# Altium project SCB.PrjPCB (part 5 of 6)

## Sheet FPGA_POWER_DGND.SchDoc
size A3
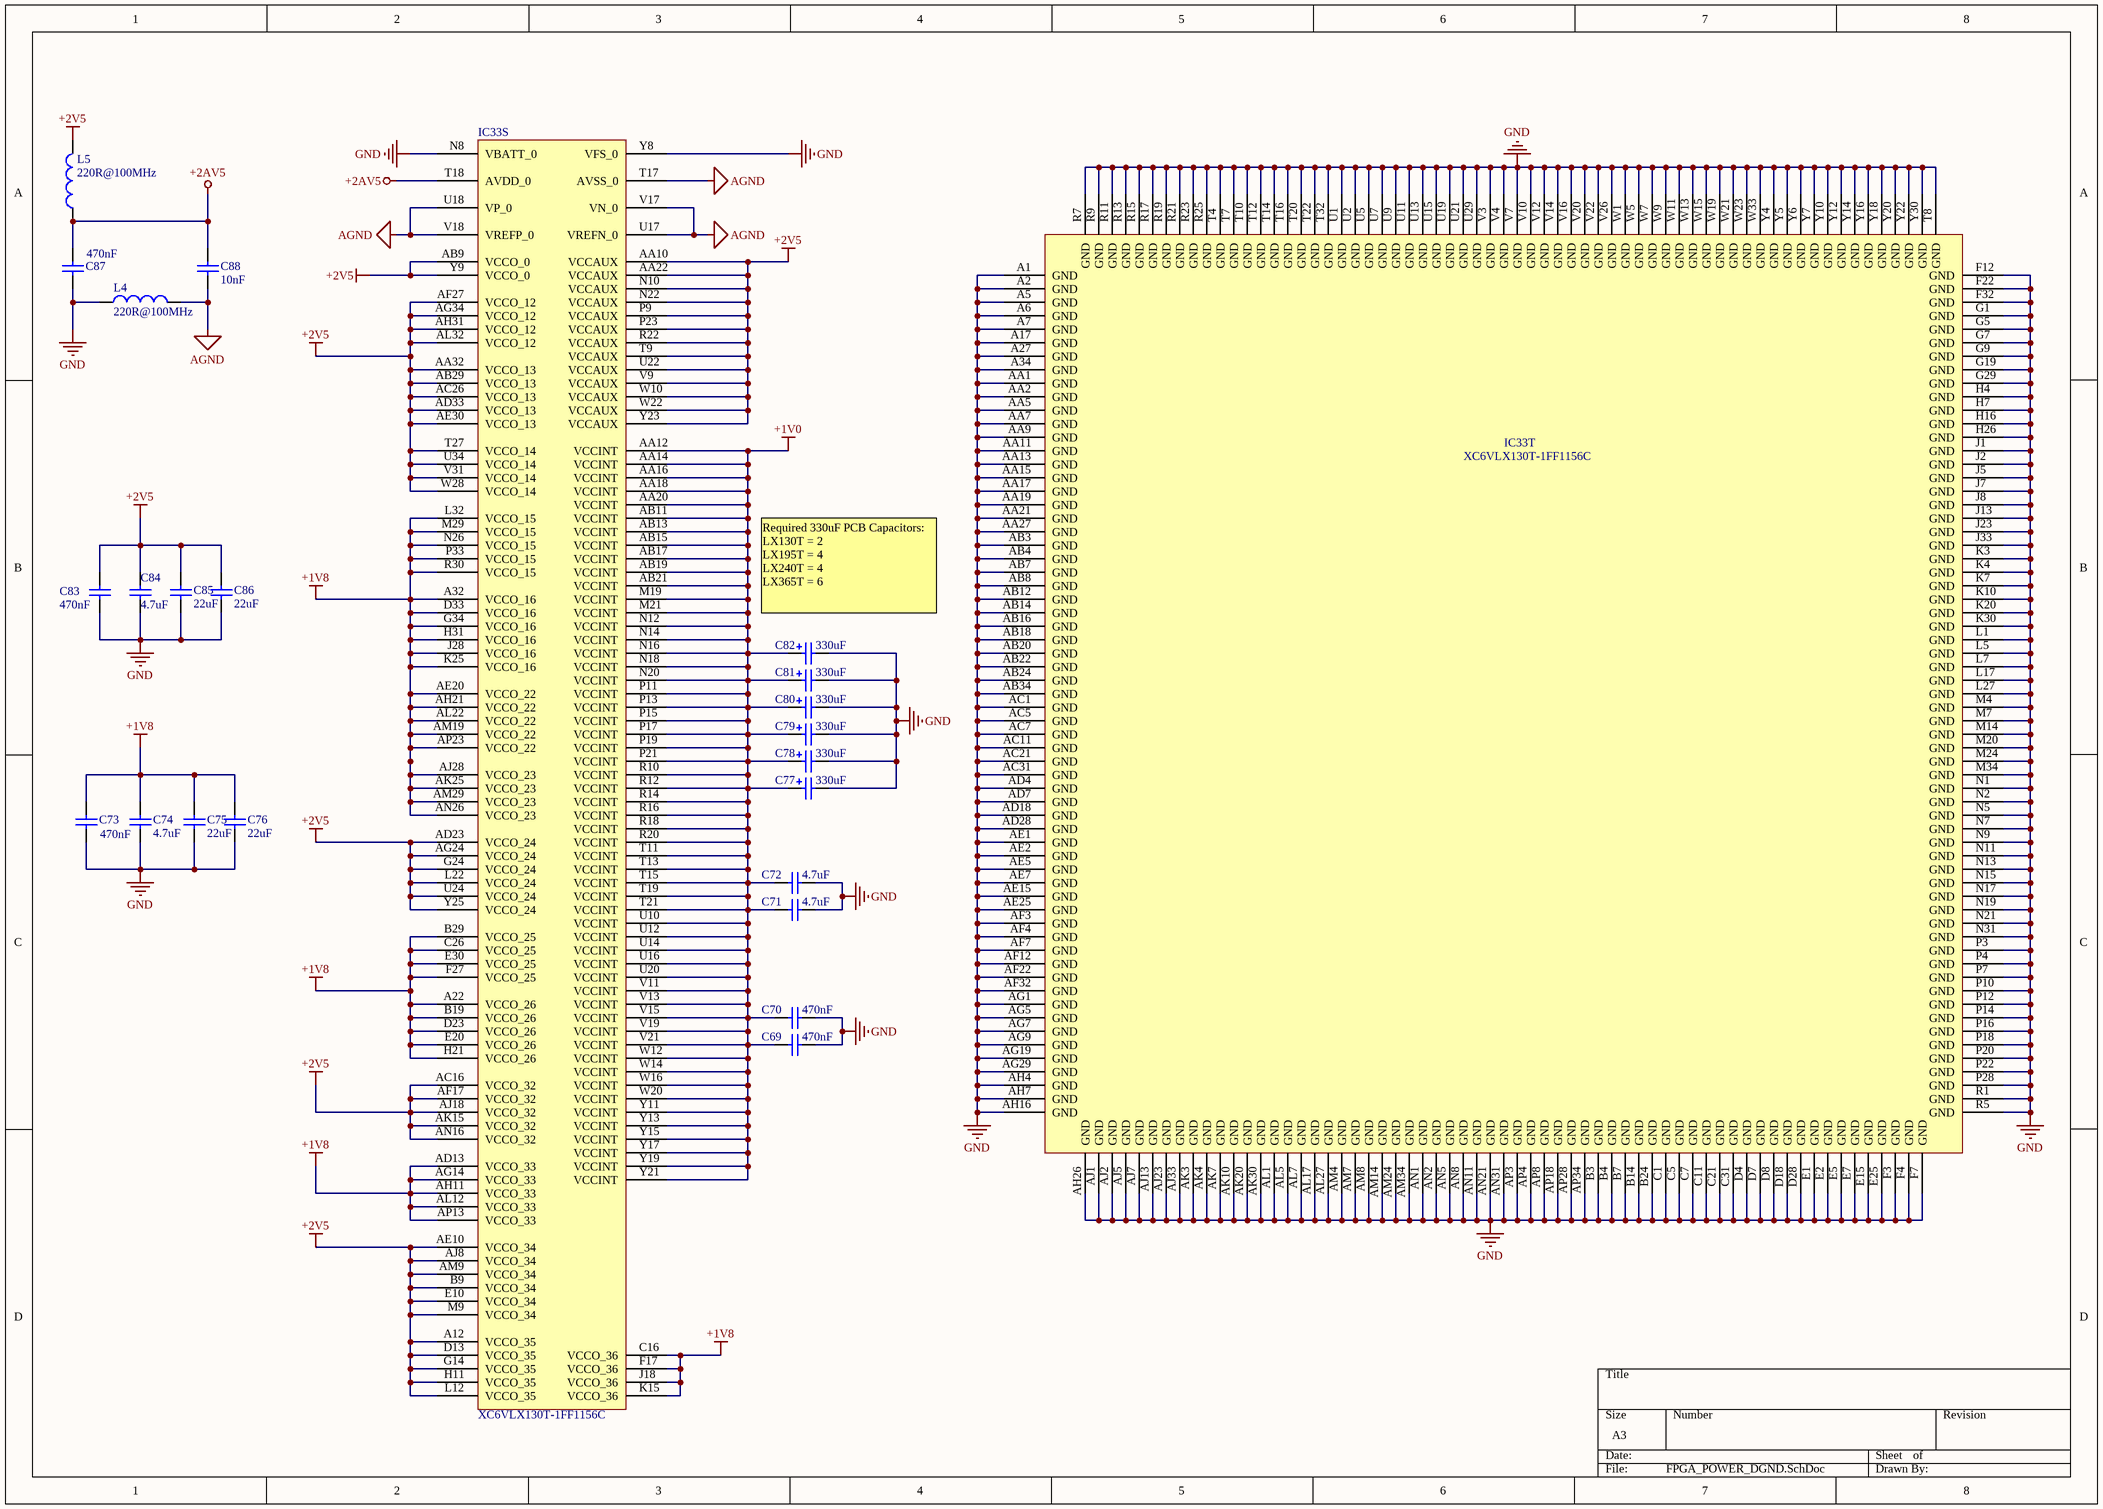
[diagram p18: FPGA_POWER_DGND.SchDoc]

### Parts
C69  470nF  [CC1005-0402]
C70  470nF  [CC1005-0402]
C71  4.7uF  [CC1608-0603]
C72  4.7uF  [CC1608-0603]
C73  470nF  [CC1005-0402]
C74  4.7uF  [CC1608-0603]
C75  22uF  [CC2012-0805]
C76  22uF  [CC2012-0805]
C77  330uF  [D]
C78  330uF  [D]
C79  330uF  [D]
C80  330uF  [D]
C81  330uF  [D]
C82  330uF  [D]
C83  470nF  [CC1005-0402]
C84  4.7uF  [CC1608-0603]
C85  22uF  [CC2012-0805]
C86  22uF  [CC2012-0805]
C87  470nF  [CC1005-0402]
C88  10nF  [CC1005-0402]
IC33  XC6VLX130T-1FF1156C  [FF1156]  (parts S,T of 20)
L4  Impedance: 220R@100MHz  [0603]  (hidden comment: 220R@100MHz Ferrite Bead)
L5  Impedance: 220R@100MHz  [0603]  (hidden comment: 220R@100MHz Ferrite Bead)

### Nets
+1V0: C69.2 C70.2 C71.1 C72.1 C77.1 C78.1 C79.1 C80.1 C81.1 C82.1 IC33.AA12(VCCINT) IC33.AA14(VCCINT) IC33.AA16(VCCINT) IC33.AA18(VCCINT) IC33.AA20(VCCINT) IC33.AB11(VCCINT) IC33.AB13(VCCINT) IC33.AB15(VCCINT) IC33.AB17(VCCINT) IC33.AB19(VCCINT) IC33.AB21(VCCINT) IC33.M19(VCCINT) IC33.M21(VCCINT) IC33.N12(VCCINT) IC33.N14(VCCINT) IC33.N16(VCCINT) IC33.N18(VCCINT) IC33.N20(VCCINT) IC33.P11(VCCINT) IC33.P13(VCCINT) IC33.P15(VCCINT) IC33.P17(VCCINT) IC33.P19(VCCINT) IC33.P21(VCCINT) IC33.R10(VCCINT) IC33.R12(VCCINT) IC33.R14(VCCINT) IC33.R16(VCCINT) IC33.R18(VCCINT) IC33.R20(VCCINT) IC33.T11(VCCINT) IC33.T13(VCCINT) IC33.T15(VCCINT) IC33.T19(VCCINT) IC33.T21(VCCINT) IC33.U10(VCCINT) IC33.U12(VCCINT) IC33.U14(VCCINT) IC33.U16(VCCINT) IC33.U20(VCCINT) IC33.V11(VCCINT) IC33.V13(VCCINT) IC33.V15(VCCINT) IC33.V19(VCCINT) IC33.V21(VCCINT) IC33.W12(VCCINT) IC33.W14(VCCINT) IC33.W16(VCCINT) IC33.W20(VCCINT) IC33.Y11(VCCINT) IC33.Y13(VCCINT) IC33.Y15(VCCINT) IC33.Y17(VCCINT) IC33.Y19(VCCINT) IC33.Y21(VCCINT)
+1V8: C73.1 C74.2 C75.2 C76.2 IC33.A22(VCCO_26) IC33.A32(VCCO_16) IC33.AD13(VCCO_33) IC33.AE20(VCCO_22) IC33.AG14(VCCO_33) IC33.AH11(VCCO_33) IC33.AH21(VCCO_22) IC33.AJ28(VCCO_23) IC33.AK25(VCCO_23) IC33.AL12(VCCO_33) IC33.AL22(VCCO_22) IC33.AM19(VCCO_22) IC33.AM29(VCCO_23) IC33.AN26(VCCO_23) IC33.AP13(VCCO_33) IC33.AP23(VCCO_22) IC33.B19(VCCO_26) IC33.B29(VCCO_25) IC33.C16(VCCO_36) IC33.C26(VCCO_25) IC33.D23(VCCO_26) IC33.D33(VCCO_16) IC33.E20(VCCO_26) IC33.E30(VCCO_25) IC33.F17(VCCO_36) IC33.F27(VCCO_25) IC33.G34(VCCO_16) IC33.H21(VCCO_26) IC33.H31(VCCO_16) IC33.J18(VCCO_36) IC33.J28(VCCO_16) IC33.K15(VCCO_36) IC33.K25(VCCO_16) IC33.L32(VCCO_15) IC33.M29(VCCO_15) IC33.N26(VCCO_15) IC33.P33(VCCO_15) IC33.R30(VCCO_15)
+2AV5: C87.1 C88.1 IC33.T18(AVDD_0) L5.1
+2V5: C83.1 C84.2 C85.2 C86.2 IC33.A12(VCCO_35) IC33.AA10(VCCAUX) IC33.AA22(VCCAUX) IC33.AA32(VCCO_13) IC33.AB9(VCCO_0) IC33.AB29(VCCO_13) IC33.AC16(VCCO_32) IC33.AC26(VCCO_13) IC33.AD23(VCCO_24) IC33.AD33(VCCO_13) IC33.AE10(VCCO_34) IC33.AE30(VCCO_13) IC33.AF17(VCCO_32) IC33.AF27(VCCO_12) IC33.AG24(VCCO_24) IC33.AG34(VCCO_12) IC33.AH31(VCCO_12) IC33.AJ8(VCCO_34) IC33.AJ18(VCCO_32) IC33.AK15(VCCO_32) IC33.AL32(VCCO_12) IC33.AM9(VCCO_34) IC33.AN16(VCCO_32) IC33.B9(VCCO_34) IC33.D13(VCCO_35) IC33.E10(VCCO_34) IC33.G14(VCCO_35) IC33.G24(VCCO_24) IC33.H11(VCCO_35) IC33.L12(VCCO_35) IC33.L22(VCCO_24) IC33.M9(VCCO_34) IC33.N10(VCCAUX) IC33.N22(VCCAUX) IC33.P9(VCCAUX) IC33.P23(VCCAUX) IC33.R22(VCCAUX) IC33.T9(VCCAUX) IC33.T27(VCCO_14) IC33.U22(VCCAUX) IC33.U24(VCCO_24) IC33.U34(VCCO_14) IC33.V9(VCCAUX) IC33.V31(VCCO_14) IC33.W10(VCCAUX) IC33.W22(VCCAUX) IC33.W28(VCCO_14) IC33.Y9(VCCO_0) IC33.Y23(VCCAUX) IC33.Y25(VCCO_24) L5.2
AGND: C88.2 IC33.T17(AVSS_0) IC33.U17(VREFN_0) IC33.U18(VP_0) IC33.V17(VN_0) IC33.V18(VREFP_0) L4.2
GND: C69.1 C70.1 C71.2 C72.2 C73.2 C74.1 C75.1 C76.1 C77.2 C78.2 C79.2 C80.2 C81.2 C82.2 C83.2 C84.1 C85.1 C86.1 C87.2 IC33.A1(GND) IC33.A2(GND) IC33.A5(GND) IC33.A6(GND) IC33.A7(GND) IC33.A17(GND) IC33.A27(GND) IC33.A34(GND) IC33.AA1(GND) IC33.AA2(GND) IC33.AA5(GND) IC33.AA7(GND) IC33.AA9(GND) IC33.AA11(GND) IC33.AA13(GND) IC33.AA15(GND) IC33.AA17(GND) IC33.AA19(GND) IC33.AA21(GND) IC33.AA27(GND) IC33.AB3(GND) IC33.AB4(GND) IC33.AB7(GND) IC33.AB8(GND) IC33.AB12(GND) IC33.AB14(GND) IC33.AB16(GND) IC33.AB18(GND) IC33.AB20(GND) IC33.AB22(GND) IC33.AB24(GND) IC33.AB34(GND) IC33.AC1(GND) IC33.AC5(GND) IC33.AC7(GND) IC33.AC11(GND) IC33.AC21(GND) IC33.AC31(GND) IC33.AD4(GND) IC33.AD7(GND) IC33.AD18(GND) IC33.AD28(GND) IC33.AE1(GND) IC33.AE2(GND) IC33.AE5(GND) IC33.AE7(GND) IC33.AE15(GND) IC33.AE25(GND) IC33.AF3(GND) IC33.AF4(GND) IC33.AF7(GND) IC33.AF12(GND) IC33.AF22(GND) IC33.AF32(GND) IC33.AG1(GND) IC33.AG5(GND) IC33.AG7(GND) IC33.AG9(GND) IC33.AG19(GND) IC33.AG29(GND) IC33.AH4(GND) IC33.AH7(GND) IC33.AH16(GND) IC33.AH26(GND) IC33.AJ1(GND) IC33.AJ2(GND) IC33.AJ5(GND) IC33.AJ7(GND) IC33.AJ13(GND) IC33.AJ23(GND) IC33.AJ33(GND) IC33.AK3(GND) IC33.AK4(GND) IC33.AK7(GND) IC33.AK10(GND) IC33.AK20(GND) IC33.AK30(GND) IC33.AL1(GND) IC33.AL5(GND) IC33.AL7(GND) IC33.AL17(GND) IC33.AL27(GND) IC33.AM4(GND) IC33.AM7(GND) IC33.AM8(GND) IC33.AM14(GND) IC33.AM24(GND) IC33.AM34(GND) IC33.AN1(GND) IC33.AN2(GND) IC33.AN5(GND) IC33.AN8(GND) IC33.AN11(GND) IC33.AN21(GND) IC33.AN31(GND) IC33.AP3(GND) IC33.AP4(GND) IC33.AP8(GND) IC33.AP18(GND) IC33.AP28(GND) IC33.AP34(GND) IC33.B3(GND) IC33.B4(GND) IC33.B7(GND) IC33.B14(GND) IC33.B24(GND) IC33.C1(GND) IC33.C5(GND) IC33.C7(GND) IC33.C11(GND) IC33.C21(GND) IC33.C31(GND) IC33.D4(GND) IC33.D7(GND) IC33.D8(GND) IC33.D18(GND) IC33.D28(GND) IC33.E1(GND) IC33.E2(GND) IC33.E5(GND) IC33.E7(GND) IC33.E15(GND) IC33.E25(GND) IC33.F3(GND) IC33.F4(GND) IC33.F7(GND) IC33.F12(GND) IC33.F22(GND) IC33.F32(GND) IC33.G1(GND) IC33.G5(GND) IC33.G7(GND) IC33.G9(GND) IC33.G19(GND) IC33.G29(GND) IC33.H4(GND) IC33.H7(GND) IC33.H16(GND) IC33.H26(GND) IC33.J1(GND) IC33.J2(GND) IC33.J5(GND) IC33.J7(GND) IC33.J8(GND) IC33.J13(GND) IC33.J23(GND) IC33.J33(GND) IC33.K3(GND) IC33.K4(GND) IC33.K7(GND) IC33.K10(GND) IC33.K20(GND) IC33.K30(GND) IC33.L1(GND) IC33.L5(GND) IC33.L7(GND) IC33.L17(GND) IC33.L27(GND) IC33.M4(GND) IC33.M7(GND) IC33.M14(GND) IC33.M20(GND) IC33.M24(GND) IC33.M34(GND) IC33.N1(GND) IC33.N2(GND) IC33.N5(GND) IC33.N7(GND) IC33.N8(VBATT_0) IC33.N9(GND) IC33.N11(GND) IC33.N13(GND) IC33.N15(GND) IC33.N17(GND) IC33.N19(GND) IC33.N21(GND) IC33.N31(GND) IC33.P3(GND) IC33.P4(GND) IC33.P7(GND) IC33.P10(GND) IC33.P12(GND) IC33.P14(GND) IC33.P16(GND) IC33.P18(GND) IC33.P20(GND) IC33.P22(GND) IC33.P28(GND) IC33.R1(GND) IC33.R5(GND) IC33.R7(GND) IC33.R9(GND) IC33.R11(GND) IC33.R13(GND) IC33.R15(GND) IC33.R17(GND) IC33.R19(GND) IC33.R21(GND) IC33.R23(GND) IC33.R25(GND) IC33.T4(GND) IC33.T7(GND) IC33.T8(GND) IC33.T10(GND) IC33.T12(GND) IC33.T14(GND) IC33.T16(GND) IC33.T20(GND) IC33.T22(GND) IC33.T32(GND) IC33.U1(GND) IC33.U2(GND) IC33.U5(GND) IC33.U7(GND) IC33.U9(GND) IC33.U11(GND) IC33.U13(GND) IC33.U15(GND) IC33.U19(GND) IC33.U21(GND) IC33.U29(GND) IC33.V3(GND) IC33.V4(GND) IC33.V7(GND) IC33.V10(GND) IC33.V12(GND) IC33.V14(GND) IC33.V16(GND) IC33.V20(GND) IC33.V22(GND) IC33.V26(GND) IC33.W1(GND) IC33.W5(GND) IC33.W7(GND) IC33.W9(GND) IC33.W11(GND) IC33.W13(GND) IC33.W15(GND) IC33.W19(GND) IC33.W21(GND) IC33.W23(GND) IC33.W33(GND) IC33.Y4(GND) IC33.Y5(GND) IC33.Y6(GND) IC33.Y7(GND) IC33.Y8(VFS_0) IC33.Y10(GND) IC33.Y12(GND) IC33.Y14(GND) IC33.Y16(GND) IC33.Y18(GND) IC33.Y20(GND) IC33.Y22(GND) IC33.Y30(GND) L4.1

### Notes on the sheet
- (near C82) Required 330uF PCB Capacitors:
  LX130T = 2
  LX195T = 4
  LX240T = 4
  LX365T = 6

### Library data of the parts
C69 C70 C73 C83 C87 = CC0402_470NF_16V_10%_X5R: Capacitor; Manufacturer1: TDK; Manufacturer1 PN: C1005X5R1C474K; TC: X5R; Tolerance: ±10%; Voltage: 16V; Published: 8-Jun-2000; LatestRevisionDate: 17-Jul-2002; LatestRevisionNote: Re-released for DXP Platform.; PackageReference: RAD-0.3; Publisher: Altium Limited; Distributor1: Digikey; Distributor1 PN: 445-4976-1-ND; Case: 0402; Value: 470nF
C71 C72 C74 C84 = CC0603_4.7UF_10V_10%_X5R: as C238 on sheet Power_Supply; Published: 8-Jun-2000; LatestRevisionDate: 17-Jul-2002; LatestRevisionNote: Re-released for DXP Platform.; PackageReference: RAD-0.3; Publisher: Altium Limited; Distributor1: Digikey; Distributor1 PN: 445-5170-1-ND; Case: 0603; Value: 4.7uF
C75 C76 C85 C86 = CC0805_22UF_6.3V_20%_X5R: Capacitor; Manufacturer1: TDK; Manufacturer1 PN: C2012X5R0J226M; TC: X5R; Tolerance: ±20%; Voltage: 6.3V; Published: 8-Jun-2000; LatestRevisionDate: 17-Jul-2002; LatestRevisionNote: Re-released for DXP Platform.; PackageReference: RAD-0.3; Publisher: Altium Limited; Distributor1: Digikey; Distributor1 PN: 445-1422-1-ND; Case: 0805; Value: 22uF
C77-C82 = CP2917_330UF_6.3V_20%_TANT: Polarized Capacitor Tantalum; Manufacturer1: Kemet; Manufacturer1 PN: T520D337M006ATE025; Tolerance: ±20%; Voltage: 6.3V; ESR: 25mOhm; Published: 8-Jun-2000; LatestRevisionDate: 17-Jul-2002; LatestRevisionNote: Re-released for DXP Platform.; PackageReference: RB7.6-15; Publisher: Altium Limited; Case: 2917; Distributor1: Digikey; Distributor1 PN: 399-4053-1-ND; TC: Tantalum; Value: 330uF
C88 = CC0402_10NF_25V_10%_X7R: Capacitor; Manufacturer1: TDK; Manufacturer1 PN: C1005X7R1E103K; TC: X7R; Tolerance: ±10%; Voltage: 25V; Published: 8-Jun-2000; LatestRevisionDate: 17-Jul-2002; LatestRevisionNote: Re-released for DXP Platform.; PackageReference: RAD-0.3; Publisher: Altium Limited; Distributor1: Digikey; Distributor1 PN: 445-1260-1-ND; Case: 0402; Value: 10nF
IC33 = XC6VLX130T-1FF1156C: as IC33 on sheet FPGA_GPIOs; FirstPublished: 17-Nov-2009; DatasheetVersion: v2.0, Sep-2009; PackageVersion: ver1.0, Jun-2009; PackageReference: FF1156; Publisher: Altium Limited; PackageDescription: 1156-Ball Flip-Chip Fine Pitch Ball Grid Array (FF1156); Code_JEDEC: MS-034-AAR-1; Code_IPC: BGA100P34X34-1156; ComponentLink1Description: Virtex-6 Datasheet; ComponentLink1URL: http://www.xilinx.com/support/documentation/data_sheets/ds150.pdf; ComponentLink2Description: Pinout Specification; ComponentLink2URL: http://www.xilinx.com/support/packagefiles/virtex-6-pkgs.htm; ComponentLink3Description: FF1156 Package Drawing; ComponentLink3URL: http://www.xilinx.com/support/documentation/package_specs/ff1156.pdf; ComponentLink4Description: Virtex-6 Documents; ComponentLink4URL: http://www.xilinx.com/support/documentation/virtex-6.htm; ComponentLink5Description: Xilinx.com Home; ComponentLink5URL: http://www.xilinx.com
L4 L5 = L_FERRITE_BEAD: as L6-L8 on sheet SCB_PLLs; Case: 0603; Distributor1: Digikey; Distributor1 PN: 490-5255-1-ND

## Sheet QDRII_mem.SchDoc
size A3
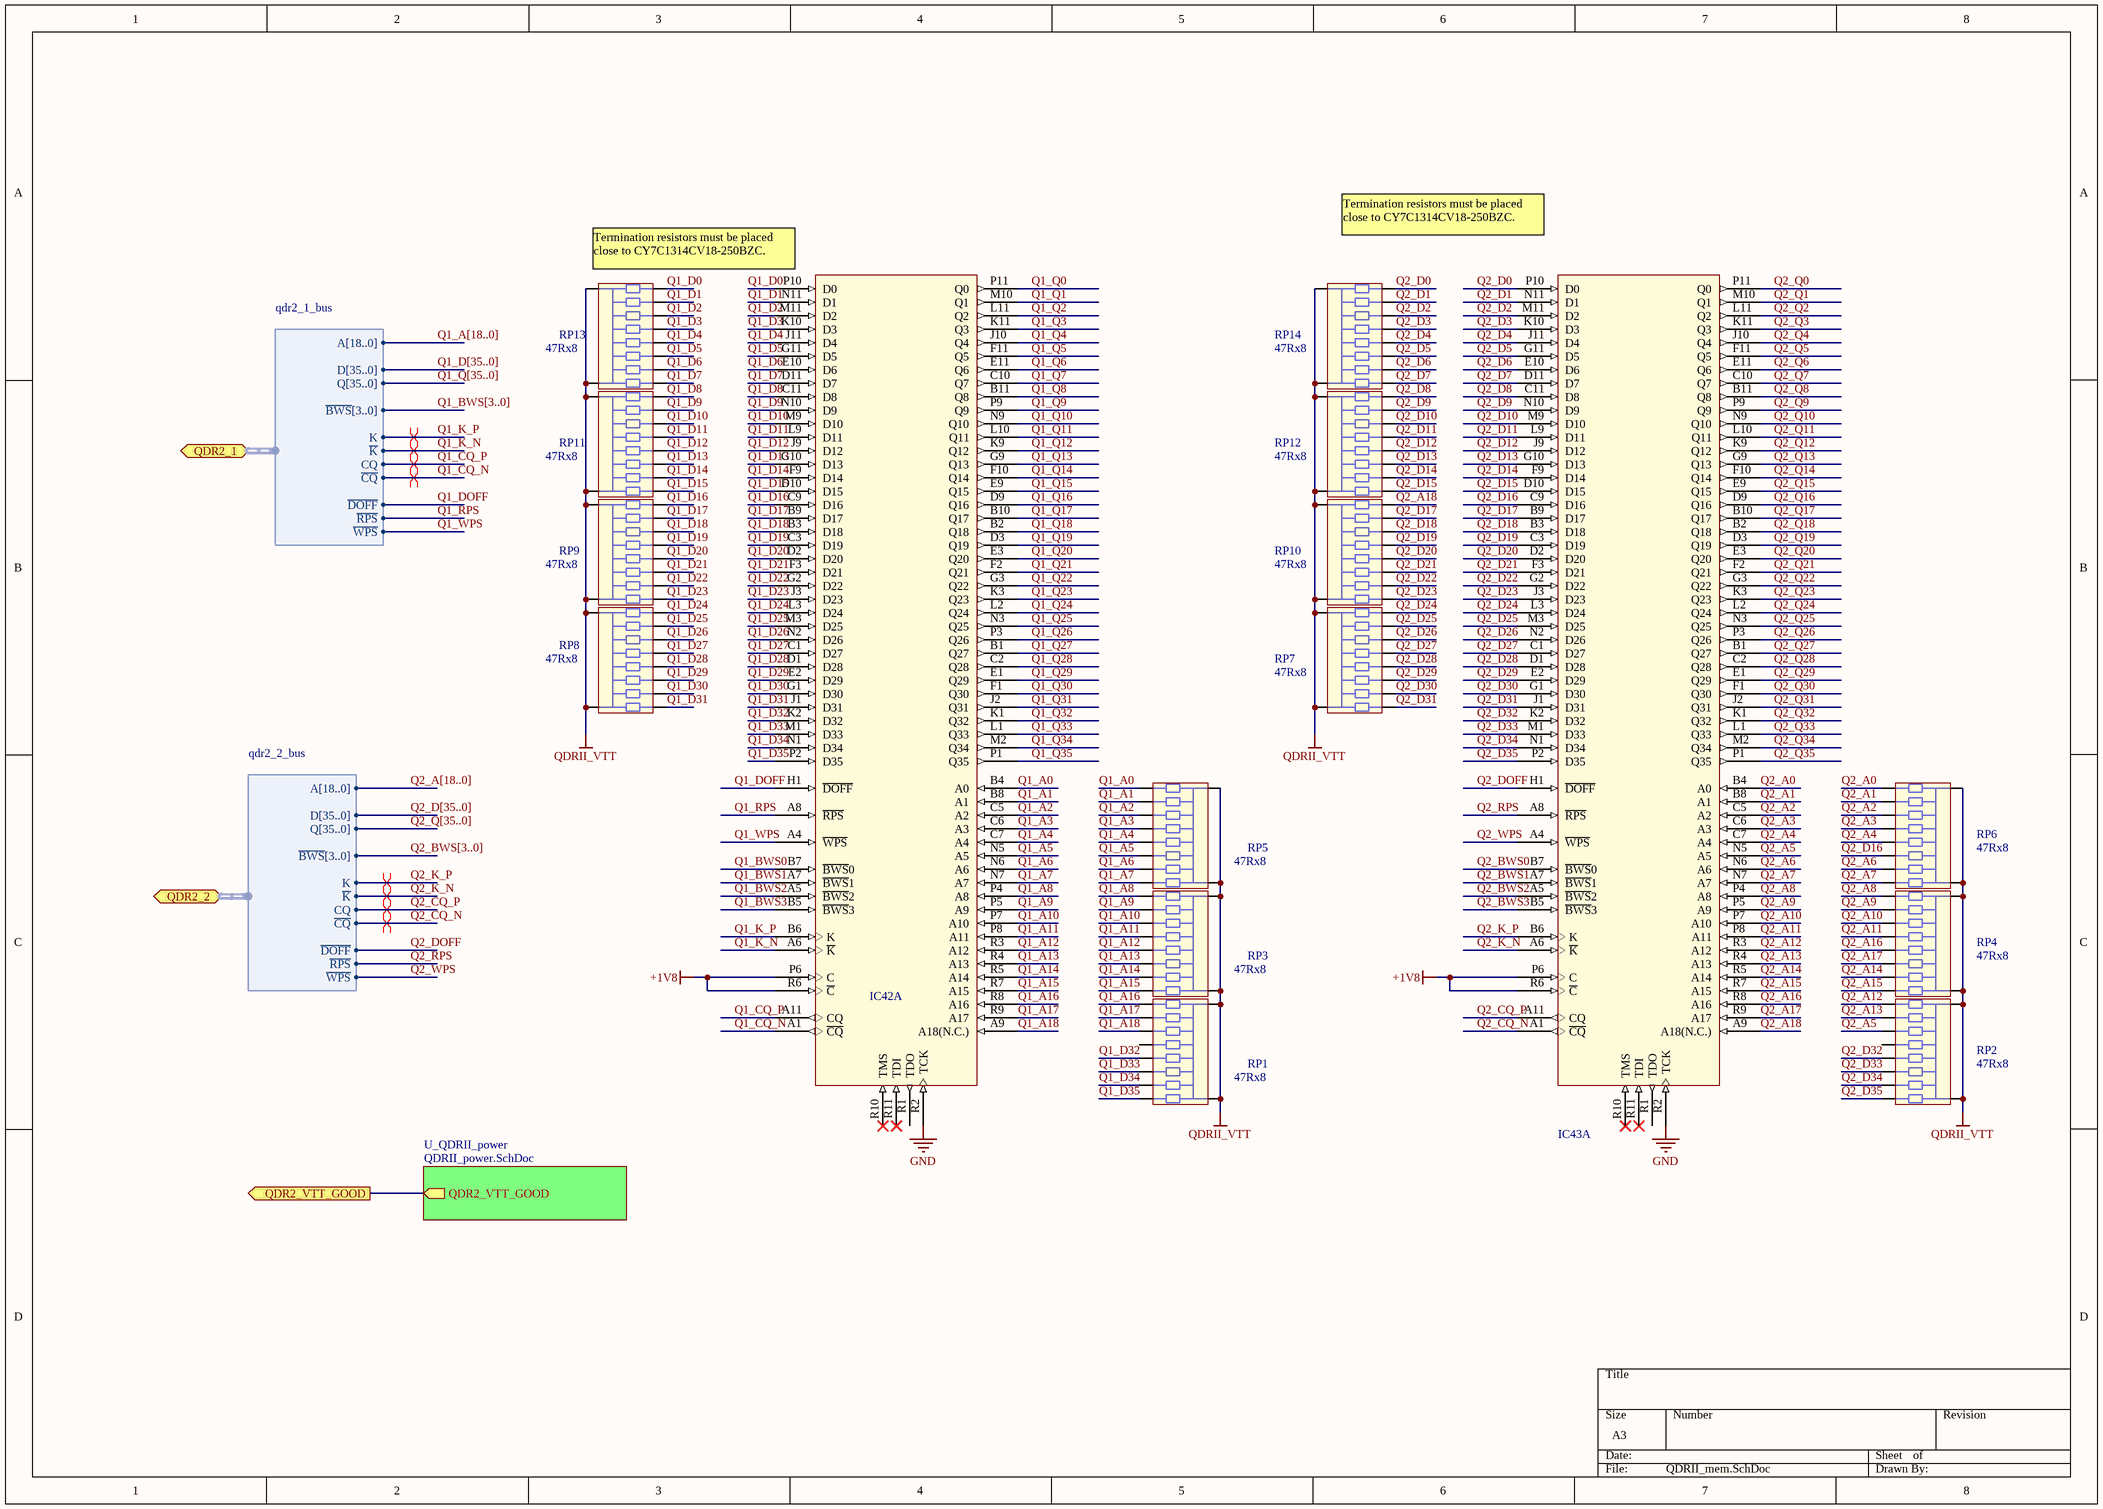
[diagram p19: QDRII_mem.SchDoc]

### Parts
IC42  CY7C1314CV18-250BZC  [BGA165C100P11X15_1300X1500X140]  (value not drawn)  (part A of 2)
IC43  CY7C1314CV18-250BZC  [BGA165C100P11X15_1300X1500X140]  (value not drawn)  (part A of 2)
RP1  value 47Rx8  [EXBE]  (hidden comment: 47R x 8)
RP2  value 47Rx8  [EXBE]  (hidden comment: 47R x 8)
RP3  value 47Rx8  [EXBE]  (hidden comment: 47R x 8)
RP4  value 47Rx8  [EXBE]  (hidden comment: 47R x 8)
RP5  value 47Rx8  [EXBE]  (hidden comment: 47R x 8)
RP6  value 47Rx8  [EXBE]  (hidden comment: 47R x 8)
RP7  value 47Rx8  [EXBE]  (hidden comment: 47R x 8)
RP8  value 47Rx8  [EXBE]  (hidden comment: 47R x 8)
RP9  value 47Rx8  [EXBE]  (hidden comment: 47R x 8)
RP10  value 47Rx8  [EXBE]  (hidden comment: 47R x 8)
RP11  value 47Rx8  [EXBE]  (hidden comment: 47R x 8)
RP12  value 47Rx8  [EXBE]  (hidden comment: 47R x 8)
RP13  value 47Rx8  [EXBE]  (hidden comment: 47R x 8)
RP14  value 47Rx8  [EXBE]  (hidden comment: 47R x 8)

### Sub-sheets
U_QDRII_power = QDRII_power.SchDoc: QDR2_VTT_GOOD (out)

### Ports
QDR2_1 (harness qdr2_1_bus), QDR2_2 (harness qdr2_2_bus), QDR2_VTT_GOOD (out)

### Harnesses
qdr2_2_bus: A[18..0], ~{BWS}[3..0], ~{CQ}, CQ, D[35..0], ~{DOFF}, K, ~{K}, Q[35..0], ~{RPS}, ~{WPS}
qdr2_1_bus: A[18..0], ~{BWS}[3..0], ~{CQ}, CQ, D[35..0], ~{DOFF}, K, ~{K}, Q[35..0], ~{RPS}, ~{WPS}

### Nets
+1V8: IC42.P6(C) IC42.R6(~{C}) IC43.P6(C) IC43.R6(~{C})
GND: IC42.R2(TCK) IC43.R2(TCK)
QDRII_VTT: RP1.1 RP1.6 RP2.1 RP2.6 RP3.1 RP3.6 RP4.1 RP4.6 RP5.1 RP5.6 RP6.1 RP6.6 RP7.1 RP7.6 RP8.1 RP8.6 RP9.1 RP9.6 RP10.1 RP10.6 RP11.1 RP11.6 RP12.1 RP12.6 RP13.1 RP13.6 RP14.1 RP14.6
Q1_A0: IC42.B4(A0) RP5.2
Q1_A1: IC42.B8(A1) RP5.3
Q1_A2: IC42.C5(A2) RP5.4
Q1_A3: IC42.C6(A3) RP5.5
Q1_A4: IC42.C7(A4) RP5.7
Q1_A5: IC42.N5(A5) RP5.8
Q1_A6: IC42.N6(A6) RP5.9
Q1_A7: IC42.N7(A7) RP5.10
Q1_A8: IC42.P4(A8) RP3.2
Q1_A9: IC42.P5(A9) RP3.3
Q1_A10: IC42.P7(A10) RP3.4
Q1_A11: IC42.P8(A11) RP3.5
Q1_A12: IC42.R3(A12) RP3.7
Q1_A13: IC42.R4(A13) RP3.8
Q1_A14: IC42.R5(A14) RP3.9
Q1_A15: IC42.R7(A15) RP3.10
Q1_A16: IC42.R8(A16) RP1.2
Q1_A17: IC42.R9(A17) RP1.3
Q1_A18: IC42.A9(A18(N.C.)) RP1.4
Q1_BWS0: IC42.B7(~{BWS}0)
Q1_BWS1: IC42.A7(~{BWS}1)
Q1_BWS2: IC42.A5(~{BWS}2)
Q1_BWS3: IC42.B5(~{BWS}3)
Q1_CQ_N: IC42.A1(~{CQ}) ; port QDR2_1.~{CQ}
Q1_CQ_P: IC42.A11(CQ) ; port QDR2_1.CQ
Q1_D0: IC42.P10(D0) RP13.10
Q1_D1: IC42.N11(D1) RP13.9
Q1_D2: IC42.M11(D2) RP13.8
Q1_D3: IC42.K10(D3) RP13.7
Q1_D4: IC42.J11(D4) RP13.5
Q1_D5: IC42.G11(D5) RP13.4
Q1_D6: IC42.E10(D6) RP13.3
Q1_D7: IC42.D11(D7) RP13.2
Q1_D8: IC42.C11(D8) RP11.10
Q1_D9: IC42.N10(D9) RP11.9
Q1_D10: IC42.M9(D10) RP11.8
Q1_D11: IC42.L9(D11) RP11.7
Q1_D12: IC42.J9(D12) RP11.5
Q1_D13: IC42.G10(D13) RP11.4
Q1_D14: IC42.F9(D14) RP11.3
Q1_D15: IC42.D10(D15) RP11.2
Q1_D16: IC42.C9(D16) RP9.10
Q1_D17: IC42.B9(D17) RP9.9
Q1_D18: IC42.B3(D18) RP9.8
Q1_D19: IC42.C3(D19) RP9.7
Q1_D20: IC42.D2(D20) RP9.5
Q1_D21: IC42.F3(D21) RP9.4
Q1_D22: IC42.G2(D22) RP9.3
Q1_D23: IC42.J3(D23) RP9.2
Q1_D24: IC42.L3(D24) RP8.10
Q1_D25: IC42.M3(D25) RP8.9
Q1_D26: IC42.N2(D26) RP8.8
Q1_D27: IC42.C1(D27) RP8.7
Q1_D28: IC42.D1(D28) RP8.5
Q1_D29: IC42.E2(D29) RP8.4
Q1_D30: IC42.G1(D30) RP8.3
Q1_D31: IC42.J1(D31) RP8.2
Q1_D32: IC42.K2(D32) RP1.7
Q1_D33: IC42.M1(D33) RP1.8
Q1_D34: IC42.N1(D34) RP1.9
Q1_D35: IC42.P2(D35) RP1.10
Q1_DOFF: IC42.H1(~{DOFF}) ; port QDR2_1.~{DOFF}
Q1_K_N: IC42.A6(~{K}) ; port QDR2_1.~{K}
Q1_K_P: IC42.B6(K) ; port QDR2_1.K
Q1_Q0: IC42.P11(Q0)
Q1_Q1: IC42.M10(Q1)
Q1_Q2: IC42.L11(Q2)
Q1_Q3: IC42.K11(Q3)
Q1_Q4: IC42.J10(Q4)
Q1_Q5: IC42.F11(Q5)
Q1_Q6: IC42.E11(Q6)
Q1_Q7: IC42.C10(Q7)
Q1_Q8: IC42.B11(Q8)
Q1_Q9: IC42.P9(Q9)
Q1_Q10: IC42.N9(Q10)
Q1_Q11: IC42.L10(Q11)
Q1_Q12: IC42.K9(Q12)
Q1_Q13: IC42.G9(Q13)
Q1_Q14: IC42.F10(Q14)
Q1_Q15: IC42.E9(Q15)
Q1_Q16: IC42.D9(Q16)
Q1_Q17: IC42.B10(Q17)
Q1_Q18: IC42.B2(Q18)
Q1_Q19: IC42.D3(Q19)
Q1_Q20: IC42.E3(Q20)
Q1_Q21: IC42.F2(Q21)
Q1_Q22: IC42.G3(Q22)
Q1_Q23: IC42.K3(Q23)
Q1_Q24: IC42.L2(Q24)
Q1_Q25: IC42.N3(Q25)
Q1_Q26: IC42.P3(Q26)
Q1_Q27: IC42.B1(Q27)
Q1_Q28: IC42.C2(Q28)
Q1_Q29: IC42.E1(Q29)
Q1_Q30: IC42.F1(Q30)
Q1_Q31: IC42.J2(Q31)
Q1_Q32: IC42.K1(Q32)
Q1_Q33: IC42.L1(Q33)
Q1_Q34: IC42.M2(Q34)
Q1_Q35: IC42.P1(Q35)
Q1_RPS: IC42.A8(~{RPS}) ; port QDR2_1.~{RPS}
Q1_WPS: IC42.A4(~{WPS}) ; port QDR2_1.~{WPS}
Q2_A0: IC43.B4(A0) RP6.5
Q2_A1: IC43.B8(A1) RP6.10
Q2_A2: IC43.C5(A2) RP6.7
Q2_A3: IC43.C6(A3) RP6.8
Q2_A4: IC43.C7(A4) RP6.9
Q2_A5: IC43.N5(A5) RP2.9
Q2_A6: IC43.N6(A6) RP6.3
Q2_A7: IC43.N7(A7) RP6.4
Q2_A8: IC43.P4(A8) RP4.10
Q2_A9: IC43.P5(A9) RP4.9
Q2_A10: IC43.P7(A10) RP4.5
Q2_A11: IC43.P8(A11) RP4.3
Q2_A12: IC43.R3(A12) RP2.10
Q2_A13: IC43.R4(A13) RP2.7
Q2_A14: IC43.R5(A14) RP4.8
Q2_A15: IC43.R7(A15) RP4.7
Q2_A16: IC43.R8(A16) RP4.4
Q2_A17: IC43.R9(A17) RP4.2
Q2_A18: IC43.A9(A18(N.C.)) RP10.5
Q2_BWS0: IC43.B7(~{BWS}0)
Q2_BWS1: IC43.A7(~{BWS}1)
Q2_BWS2: IC43.A5(~{BWS}2)
Q2_BWS3: IC43.B5(~{BWS}3)
Q2_CQ_N: IC43.A1(~{CQ}) ; port QDR2_2.~{CQ}
Q2_CQ_P: IC43.A11(CQ) ; port QDR2_2.CQ
Q2_D0: IC43.P10(D0) RP14.10
Q2_D1: IC43.N11(D1) RP14.9
Q2_D2: IC43.M11(D2) RP14.8
Q2_D3: IC43.K10(D3) RP14.7
Q2_D4: IC43.J11(D4) RP14.5
Q2_D5: IC43.G11(D5) RP14.4
Q2_D6: IC43.E10(D6) RP14.3
Q2_D7: IC43.D11(D7) RP14.2
Q2_D8: IC43.C11(D8) RP12.10
Q2_D9: IC43.N10(D9) RP12.9
Q2_D10: IC43.M9(D10) RP12.8
Q2_D11: IC43.L9(D11) RP12.7
Q2_D12: IC43.J9(D12) RP12.5
Q2_D13: IC43.G10(D13) RP12.4
Q2_D14: IC43.F9(D14) RP12.3
Q2_D15: IC43.D10(D15) RP12.2
Q2_D16: IC43.C9(D16) RP6.2
Q2_D17: IC43.B9(D17) RP10.4
Q2_D18: IC43.B3(D18) RP10.10
Q2_D19: IC43.C3(D19) RP10.9
Q2_D20: IC43.D2(D20) RP10.8
Q2_D21: IC43.F3(D21) RP10.2
Q2_D22: IC43.G2(D22) RP10.7
Q2_D23: IC43.J3(D23) RP10.3
Q2_D24: IC43.L3(D24) RP7.4
Q2_D25: IC43.M3(D25) RP7.3
Q2_D26: IC43.N2(D26) RP7.2
Q2_D27: IC43.C1(D27) RP7.10
Q2_D28: IC43.D1(D28) RP7.9
Q2_D29: IC43.E2(D29) RP7.8
Q2_D30: IC43.G1(D30) RP7.7
Q2_D31: IC43.J1(D31) RP7.5
Q2_D32: IC43.K2(D32) RP2.5
Q2_D33: IC43.M1(D33) RP2.4
Q2_D34: IC43.N1(D34) RP2.3
Q2_D35: IC43.P2(D35) RP2.2
Q2_DOFF: IC43.H1(~{DOFF}) ; port QDR2_2.~{DOFF}
Q2_K_N: IC43.A6(~{K}) ; port QDR2_2.~{K}
Q2_K_P: IC43.B6(K) ; port QDR2_2.K
Q2_Q0: IC43.P11(Q0)
Q2_Q1: IC43.M10(Q1)
Q2_Q2: IC43.L11(Q2)
Q2_Q3: IC43.K11(Q3)
Q2_Q4: IC43.J10(Q4)
Q2_Q5: IC43.F11(Q5)
Q2_Q6: IC43.E11(Q6)
Q2_Q7: IC43.C10(Q7)
Q2_Q8: IC43.B11(Q8)
Q2_Q9: IC43.P9(Q9)
Q2_Q10: IC43.N9(Q10)
Q2_Q11: IC43.L10(Q11)
Q2_Q12: IC43.K9(Q12)
Q2_Q13: IC43.G9(Q13)
Q2_Q14: IC43.F10(Q14)
Q2_Q15: IC43.E9(Q15)
Q2_Q16: IC43.D9(Q16)
Q2_Q17: IC43.B10(Q17)
Q2_Q18: IC43.B2(Q18)
Q2_Q19: IC43.D3(Q19)
Q2_Q20: IC43.E3(Q20)
Q2_Q21: IC43.F2(Q21)
Q2_Q22: IC43.G3(Q22)
Q2_Q23: IC43.K3(Q23)
Q2_Q24: IC43.L2(Q24)
Q2_Q25: IC43.N3(Q25)
Q2_Q26: IC43.P3(Q26)
Q2_Q27: IC43.B1(Q27)
Q2_Q28: IC43.C2(Q28)
Q2_Q29: IC43.E1(Q29)
Q2_Q30: IC43.F1(Q30)
Q2_Q31: IC43.J2(Q31)
Q2_Q32: IC43.K1(Q32)
Q2_Q33: IC43.L1(Q33)
Q2_Q34: IC43.M2(Q34)
Q2_Q35: IC43.P1(Q35)
Q2_RPS: IC43.A8(~{RPS}) ; port QDR2_2.~{RPS}
Q2_WPS: IC43.A4(~{WPS}) ; port QDR2_2.~{WPS}
QDR2_VTT_GOOD: port QDR2_VTT_GOOD, sheet U_QDRII_power/QDR2_VTT_GOOD

Not connected (* = marked no-connect by the designer): IC42 R1(TDO) R10(TMS)* R11(TDI)*; IC43 R1(TDO) R10(TMS)* R11(TDI)*; RP1 5; RP2 8

### Buses and harness runs
bus Q1_A[18..0]
bus Q1_BWS[3..0]
bus Q1_D[35..0]
bus Q1_Q[35..0]
bus Q2_A[18..0]
bus Q2_BWS[3..0]
bus Q2_D[35..0]
bus Q2_Q[35..0]

### Layout directives
differential pair: Q1_CQ_N, Q1_CQ_P, Q1_K_N, Q1_K_P, Q2_CQ_N, Q2_CQ_P, Q2_K_N, Q2_K_P

### Notes on the sheet
- Termination resistors must be placed close to CY7C1314CV18-250BZC.

### Library data of the parts
IC42 IC43 = CY7C1314CV18: 18-Mbit (512Kx36) QDRII SRAM 2-Word Burst Architecture; Value: CY7C1314CV18-250BZC; Distributor1 PN: CY7C1314CV18-250BZC -ND; Distributor1: Digikey
RP1-RP14 = EXB-E10C470J: 47R, 62.5mW Chip Resistor Bussed Network; Manufacturer1: Panasonic; Tolerance: ±5%; TCR: 200ppm; Case: EXBE; Manufacturer1 PN: EXB-E10C470J; Distributor1: DigiKey; Distributor1 PN: U8470CT-ND; Power Rating: 62.5mW

## Sheet QDRII_power.SchDoc
size A4
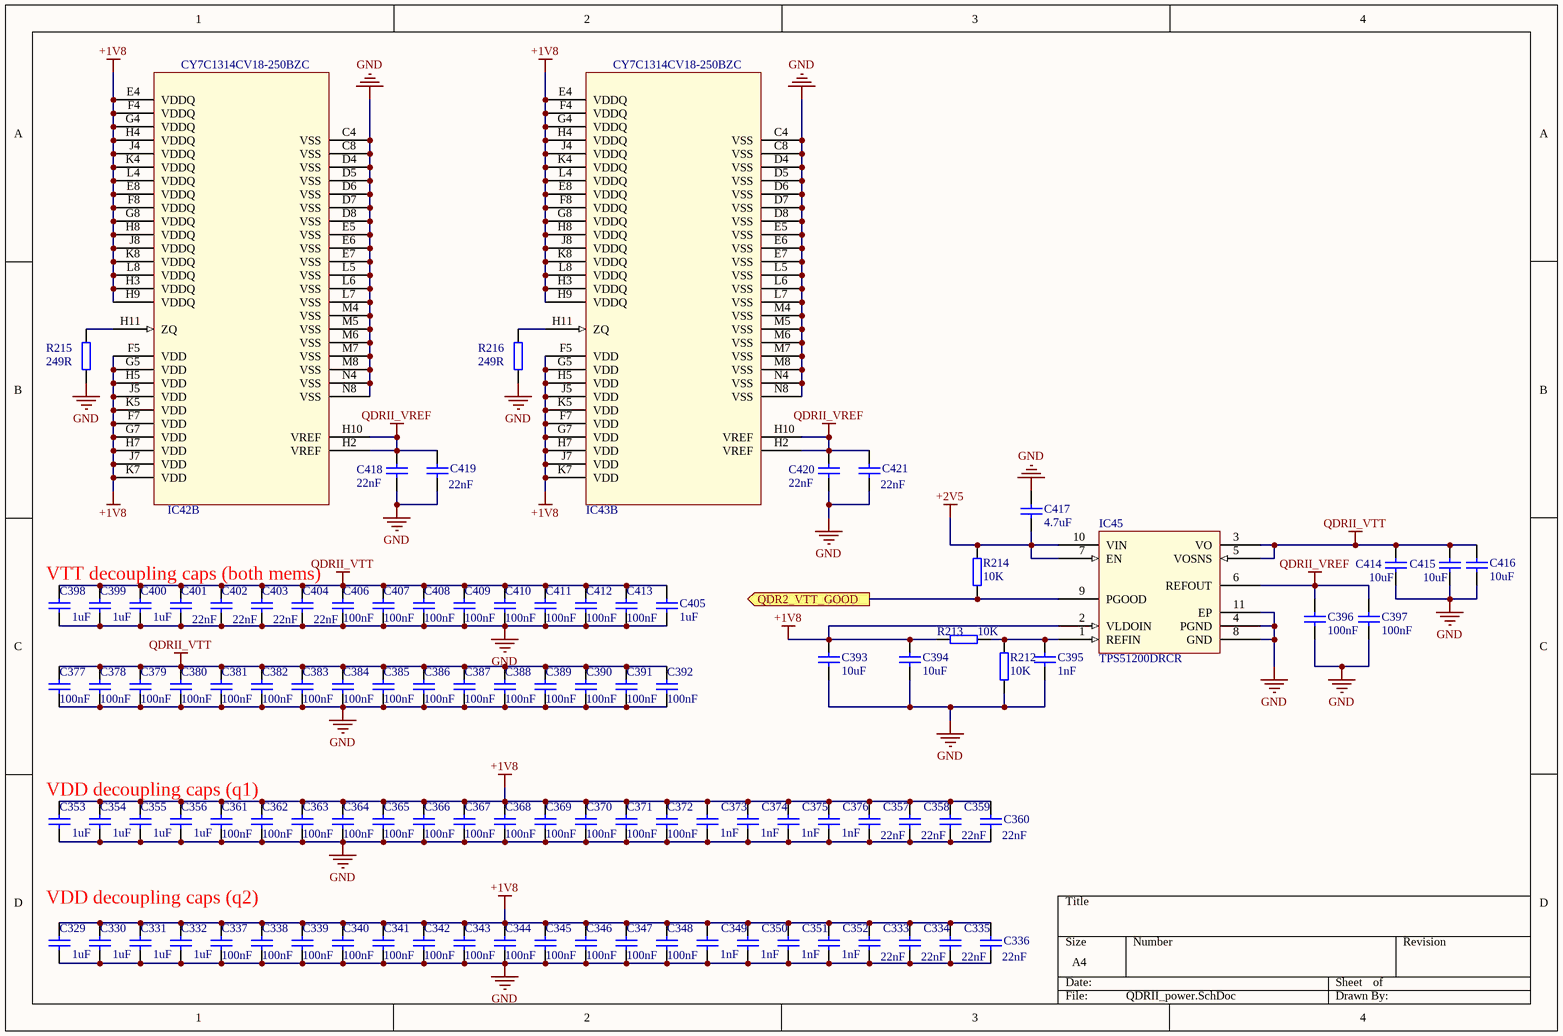
[diagram p20: QDRII_power.SchDoc]

### Parts
C329  1uF  [CC1005-0402]
C330  1uF  [CC1005-0402]
C331  1uF  [CC1005-0402]
C332  1uF  [CC1005-0402]
C333  22nF  [CC1005-0402]
C334  22nF  [CC1005-0402]
C335  22nF  [CC1005-0402]
C336  22nF  [CC1005-0402]
C337  100nF  [CC1005-0402]
C338  100nF  [CC1005-0402]
C339  100nF  [CC1005-0402]
C340  100nF  [CC1005-0402]
C341  100nF  [CC1005-0402]
C342  100nF  [CC1005-0402]
C343  100nF  [CC1005-0402]
C344  100nF  [CC1005-0402]
C345  100nF  [CC1005-0402]
C346  100nF  [CC1005-0402]
C347  100nF  [CC1005-0402]
C348  100nF  [CC1005-0402]
C349  1nF  [CC1005-0402]
C350  1nF  [CC1005-0402]
C351  1nF  [CC1005-0402]
C352  1nF  [CC1005-0402]
C353  1uF  [CC1005-0402]
C354  1uF  [CC1005-0402]
C355  1uF  [CC1005-0402]
C356  1uF  [CC1005-0402]
C357  22nF  [CC1005-0402]
C358  22nF  [CC1005-0402]
C359  22nF  [CC1005-0402]
C360  22nF  [CC1005-0402]
C361  100nF  [CC1005-0402]
C362  100nF  [CC1005-0402]
C363  100nF  [CC1005-0402]
C364  100nF  [CC1005-0402]
C365  100nF  [CC1005-0402]
C366  100nF  [CC1005-0402]
C367  100nF  [CC1005-0402]
C368  100nF  [CC1005-0402]
C369  100nF  [CC1005-0402]
C370  100nF  [CC1005-0402]
C371  100nF  [CC1005-0402]
C372  100nF  [CC1005-0402]
C373  1nF  [CC1005-0402]
C374  1nF  [CC1005-0402]
C375  1nF  [CC1005-0402]
C376  1nF  [CC1005-0402]
C377  100nF  [CC1005-0402]
C378  100nF  [CC1005-0402]
C379  100nF  [CC1005-0402]
C380  100nF  [CC1005-0402]
C381  100nF  [CC1005-0402]
C382  100nF  [CC1005-0402]
C383  100nF  [CC1005-0402]
C384  100nF  [CC1005-0402]
C385  100nF  [CC1005-0402]
C386  100nF  [CC1005-0402]
C387  100nF  [CC1005-0402]
C388  100nF  [CC1005-0402]
C389  100nF  [CC1005-0402]
C390  100nF  [CC1005-0402]
C391  100nF  [CC1005-0402]
C392  100nF  [CC1005-0402]
C393  10uF  [CC1608-0603]
C394  10uF  [CC1608-0603]
C395  1nF  [CC1005-0402]
C396  100nF  [CC1005-0402]
C397  100nF  [CC1005-0402]
C398  1uF  [CC1005-0402]
C399  1uF  [CC1005-0402]
C400  1uF  [CC1005-0402]
C401  22nF  [CC1005-0402]
C402  22nF  [CC1005-0402]
C403  22nF  [CC1005-0402]
C404  22nF  [CC1005-0402]
C405  1uF  [CC1005-0402]
C406  100nF  [CC1005-0402]
C407  100nF  [CC1005-0402]
C408  100nF  [CC1005-0402]
C409  100nF  [CC1005-0402]
C410  100nF  [CC1005-0402]
C411  100nF  [CC1005-0402]
C412  100nF  [CC1005-0402]
C413  100nF  [CC1005-0402]
C414  10uF  [CC1608-0603]
C415  10uF  [CC1608-0603]
C416  10uF  [CC1608-0603]
C417  4.7uF  [CC1608-0603]
C418  22nF  [CC1005-0402]
C419  22nF  [CC1005-0402]
C420  22nF  [CC1005-0402]
C421  22nF  [CC1005-0402]
IC42  CY7C1314CV18-250BZC  (part B of 2)
IC43  CY7C1314CV18-250BZC  (part B of 2)
IC45  TPS51200DRCR  [SON50P300X300X100-11N-R175X250]
R212  10k  [0402]
R213  10k  [0402]
R214  10k  [0402]
R215  249R  [0402]
R216  249R  [0402]

### Ports
QDR2_VTT_GOOD (out)

### Nets
+1V8: C329.2 C330.2 C331.2 C332.2 C333.2 C334.2 C335.2 C336.2 C337.1 C338.1 C339.1 C340.1 C341.1 C342.1 C343.1 C344.1 C345.1 C346.1 C347.1 C348.1 C349.2 C350.2 C351.2 C352.2 C353.2 C354.2 C355.2 C356.2 C357.2 C358.2 C359.2 C360.2 C361.1 C362.1 C363.1 C364.1 C365.1 C366.1 C367.1 C368.1 C369.1 C370.1 C371.1 C372.1 C373.2 C374.2 C375.2 C376.2 C393.2 C394.2 IC42.E4(VDDQ) IC42.E8(VDDQ) IC42.F4(VDDQ) IC42.F5(VDD) IC42.F7(VDD) IC42.F8(VDDQ) IC42.G4(VDDQ) IC42.G5(VDD) IC42.G7(VDD) IC42.G8(VDDQ) IC42.H3(VDDQ) IC42.H4(VDDQ) IC42.H5(VDD) IC42.H7(VDD) IC42.H8(VDDQ) IC42.H9(VDDQ) IC42.J4(VDDQ) IC42.J5(VDD) IC42.J7(VDD) IC42.J8(VDDQ) IC42.K4(VDDQ) IC42.K5(VDD) IC42.K7(VDD) IC42.K8(VDDQ) IC42.L4(VDDQ) IC42.L8(VDDQ) IC43.E4(VDDQ) IC43.E8(VDDQ) IC43.F4(VDDQ) IC43.F5(VDD) IC43.F7(VDD) IC43.F8(VDDQ) IC43.G4(VDDQ) IC43.G5(VDD) IC43.G7(VDD) IC43.G8(VDDQ) IC43.H3(VDDQ) IC43.H4(VDDQ) IC43.H5(VDD) IC43.H7(VDD) IC43.H8(VDDQ) IC43.H9(VDDQ) IC43.J4(VDDQ) IC43.J5(VDD) IC43.J7(VDD) IC43.J8(VDDQ) IC43.K4(VDDQ) IC43.K5(VDD) IC43.K7(VDD) IC43.K8(VDDQ) IC43.L4(VDDQ) IC43.L8(VDDQ) IC45.2(VLDOIN) R213.2
+2V5: C417.1 IC45.7(EN) IC45.10(VIN) R214.2
GND: C329.1 C330.1 C331.1 C332.1 C333.1 C334.1 C335.1 C336.1 C337.2 C338.2 C339.2 C340.2 C341.2 C342.2 C343.2 C344.2 C345.2 C346.2 C347.2 C348.2 C349.1 C350.1 C351.1 C352.1 C353.1 C354.1 C355.1 C356.1 C357.1 C358.1 C359.1 C360.1 C361.2 C362.2 C363.2 C364.2 C365.2 C366.2 C367.2 C368.2 C369.2 C370.2 C371.2 C372.2 C373.1 C374.1 C375.1 C376.1 C377.2 C378.2 C379.2 C380.2 C381.2 C382.2 C383.2 C384.2 C385.2 C386.2 C387.2 C388.2 C389.2 C390.2 C391.2 C392.2 C393.1 C394.1 C395.1 C396.2 C397.2 C398.1 C399.1 C400.1 C401.1 C402.1 C403.1 C404.1 C405.1 C406.2 C407.2 C408.2 C409.2 C410.2 C411.2 C412.2 C413.2 C414.1 C415.1 C416.1 C417.2 C418.1 C419.1 C420.1 C421.1 IC42.C4(VSS) IC42.C8(VSS) IC42.D4(VSS) IC42.D5(VSS) IC42.D6(VSS) IC42.D7(VSS) IC42.D8(VSS) IC42.E5(VSS) IC42.E6(VSS) IC42.E7(VSS) IC42.L5(VSS) IC42.L6(VSS) IC42.L7(VSS) IC42.M4(VSS) IC42.M5(VSS) IC42.M6(VSS) IC42.M7(VSS) IC42.M8(VSS) IC42.N4(VSS) IC42.N8(VSS) IC43.C4(VSS) IC43.C8(VSS) IC43.D4(VSS) IC43.D5(VSS) IC43.D6(VSS) IC43.D7(VSS) IC43.D8(VSS) IC43.E5(VSS) IC43.E6(VSS) IC43.E7(VSS) IC43.L5(VSS) IC43.L6(VSS) IC43.L7(VSS) IC43.M4(VSS) IC43.M5(VSS) IC43.M6(VSS) IC43.M7(VSS) IC43.M8(VSS) IC43.N4(VSS) IC43.N8(VSS) IC45.4(PGND) IC45.8(GND) IC45.11(EP) R212.1 R215.1 R216.1
QDRII_VREF: C396.1 C397.1 C418.2 C419.2 C420.2 C421.2 IC42.H2(VREF) IC42.H10(VREF) IC43.H2(VREF) IC43.H10(VREF) IC45.6(REFOUT)  [project net VREFQDRII]
QDRII_VTT: C377.1 C378.1 C379.1 C380.1 C381.1 C382.1 C383.1 C384.1 C385.1 C386.1 C387.1 C388.1 C389.1 C390.1 C391.1 C392.1 C398.2 C399.2 C400.2 C401.2 C402.2 C403.2 C404.2 C405.2 C406.1 C407.1 C408.1 C409.1 C410.1 C411.1 C412.1 C413.1 C414.2 C415.2 C416.2 IC45.3(VO) IC45.5(VOSNS)
QDR2_VTT_GOOD: IC45.9(PGOOD) R214.1 ; port QDR2_VTT_GOOD
NetC395_2: C395.2 IC45.1(REFIN) R212.2 R213.1
NetIC42_H11: IC42.H11(ZQ) R215.2
NetIC43_H11: IC43.H11(ZQ) R216.2

### Notes on the sheet
- VTT decoupling caps (both mems)
- VDD decoupling caps (q1)
- VDD decoupling caps (q2)

### Library data of the parts
C329-C332 C353-C356 C398-C400 C405 = CC0402_1UF_16V_10%_X5R: Capacitor; Manufacturer1: TDK; Manufacturer1 PN: C1005X5R1C105K; TC: X5R; Tolerance: ±10%; Voltage: 16V; Published: 8-Jun-2000; LatestRevisionDate: 17-Jul-2002; LatestRevisionNote: Re-released for DXP Platform.; PackageReference: RAD-0.3; Publisher: Altium Limited; Distributor1: Digikey; Distributor1 PN: 445-4978-1-ND; Case: 0402; Value: 1uF
C333-C336 C357-C360 C401-C404 C418-C421 = CC0402_22NF_25V_10%_X7R: Capacitor; Manufacturer1: TDK; Manufacturer1 PN: C1005X7R1E223K; TC: X7R; Tolerance: ±10%; Voltage: 25V; Published: 8-Jun-2000; LatestRevisionDate: 17-Jul-2002; LatestRevisionNote: Re-released for DXP Platform.; PackageReference: RAD-0.3; Publisher: Altium Limited; Distributor1: Digikey; Distributor1 PN: 445-1261-1-ND; Case: 0402; Value: 22nF
C337-C348 C361-C372 C377-C392 C396 C397 C406-C413 = CC0402_100NF_16V_10%_X7R: Capacitor; Manufacturer1: TDK; Manufacturer1 PN: C1005X7R1C104K; TC: X7R; Tolerance: ±10%; Voltage: 16V; Published: 8-Jun-2000; LatestRevisionDate: 17-Jul-2002; LatestRevisionNote: Re-released for DXP Platform.; PackageReference: RAD-0.3; Publisher: Altium Limited; Distributor1: Digikey; Distributor1 PN: 445-4952-1-ND; Case: 0402; Value: 100nF
C349-C352 C373-C376 C395 = CC0402_1NF_25V_10%_X7R: Capacitor; Manufacturer1: TDK; Manufacturer1 PN: C1005X7R1E102K; TC: X7R; Tolerance: ±10%; Voltage: 25V; Published: 8-Jun-2000; LatestRevisionDate: 17-Jul-2002; LatestRevisionNote: Re-released for DXP Platform.; PackageReference: RAD-0.3; Publisher: Altium Limited; Distributor1: Digikey; Distributor1 PN: 445-4924-1-ND; Case: 0402; Value: 1nF
C393 C394 C414-C416 = CC0603_10UF_6.3V_20%_X5R: Capacitor; Manufacturer1: TDK; Manufacturer1 PN: C1608X5R0J106M; TC: X5R; Tolerance: ±20%; Voltage: 6.3V; Published: 8-Jun-2000; LatestRevisionDate: 17-Jul-2002; LatestRevisionNote: Re-released for DXP Platform.; PackageReference: RAD-0.3; Publisher: Altium Limited; Distributor1: Digikey; Distributor1 PN: 445-4112-1-ND; Case: 0603; Value: 10uF
C417 = CC0603_4.7UF_10V_10%_X5R: Capacitor; Manufacturer1: TDK; Manufacturer1 PN: C1608X5R1A475K; TC: X5R; Tolerance: ±10%; Voltage: 10V; Published: 8-Jun-2000; LatestRevisionDate: 17-Jul-2002; LatestRevisionNote: Re-released for DXP Platform.; PackageReference: RAD-0.3; Publisher: Altium Limited; Distributor1: Digikey; Distributor1 PN: 445-5170-1-ND; Case: 0603; Value: 4.7uF
IC42 IC43 = CY7C1314CV18: as IC42 on sheet QDRII_mem; Value: CY7C1314CV18-250BZC; Distributor1 PN: CY7C1314CV18-250BZC -ND; Distributor1: Digikey
IC45 = TPS51200: Sink/Source DDR Termination Regulator; Value: TPS51200DRCR; Distributor1 PN: 296-26978-1-ND; Distributor1: Digikey
R212-R214 = R0402_10K_±1%_0.1W_100PPM: SMD Resistor; Manufacturer1: Panasonic; Manufacturer1 PN: ERJ-2RKF1002X; TCR: 100ppm; Power Rating: 0.1W; Tolerance: ±1%; Case: 0402; Distributor1: DigiKey; Distributor1 PN: P10.0KLCT-ND; Value: 10K
R215 R216 = R0402_249R_±1%_0.1W_100PPM: SMD Resistor; Manufacturer1: Panasonic; Manufacturer1 PN: ERJ-2RKF2490X; TCR: 100ppm; Power Rating: 0.1W; Tolerance: ±1%; Case: 0402; Distributor1: DigiKey; Distributor1 PN: P249LCT-ND; Value: 249R

## Sheet FPGA_QDRII.SchDoc
size A3
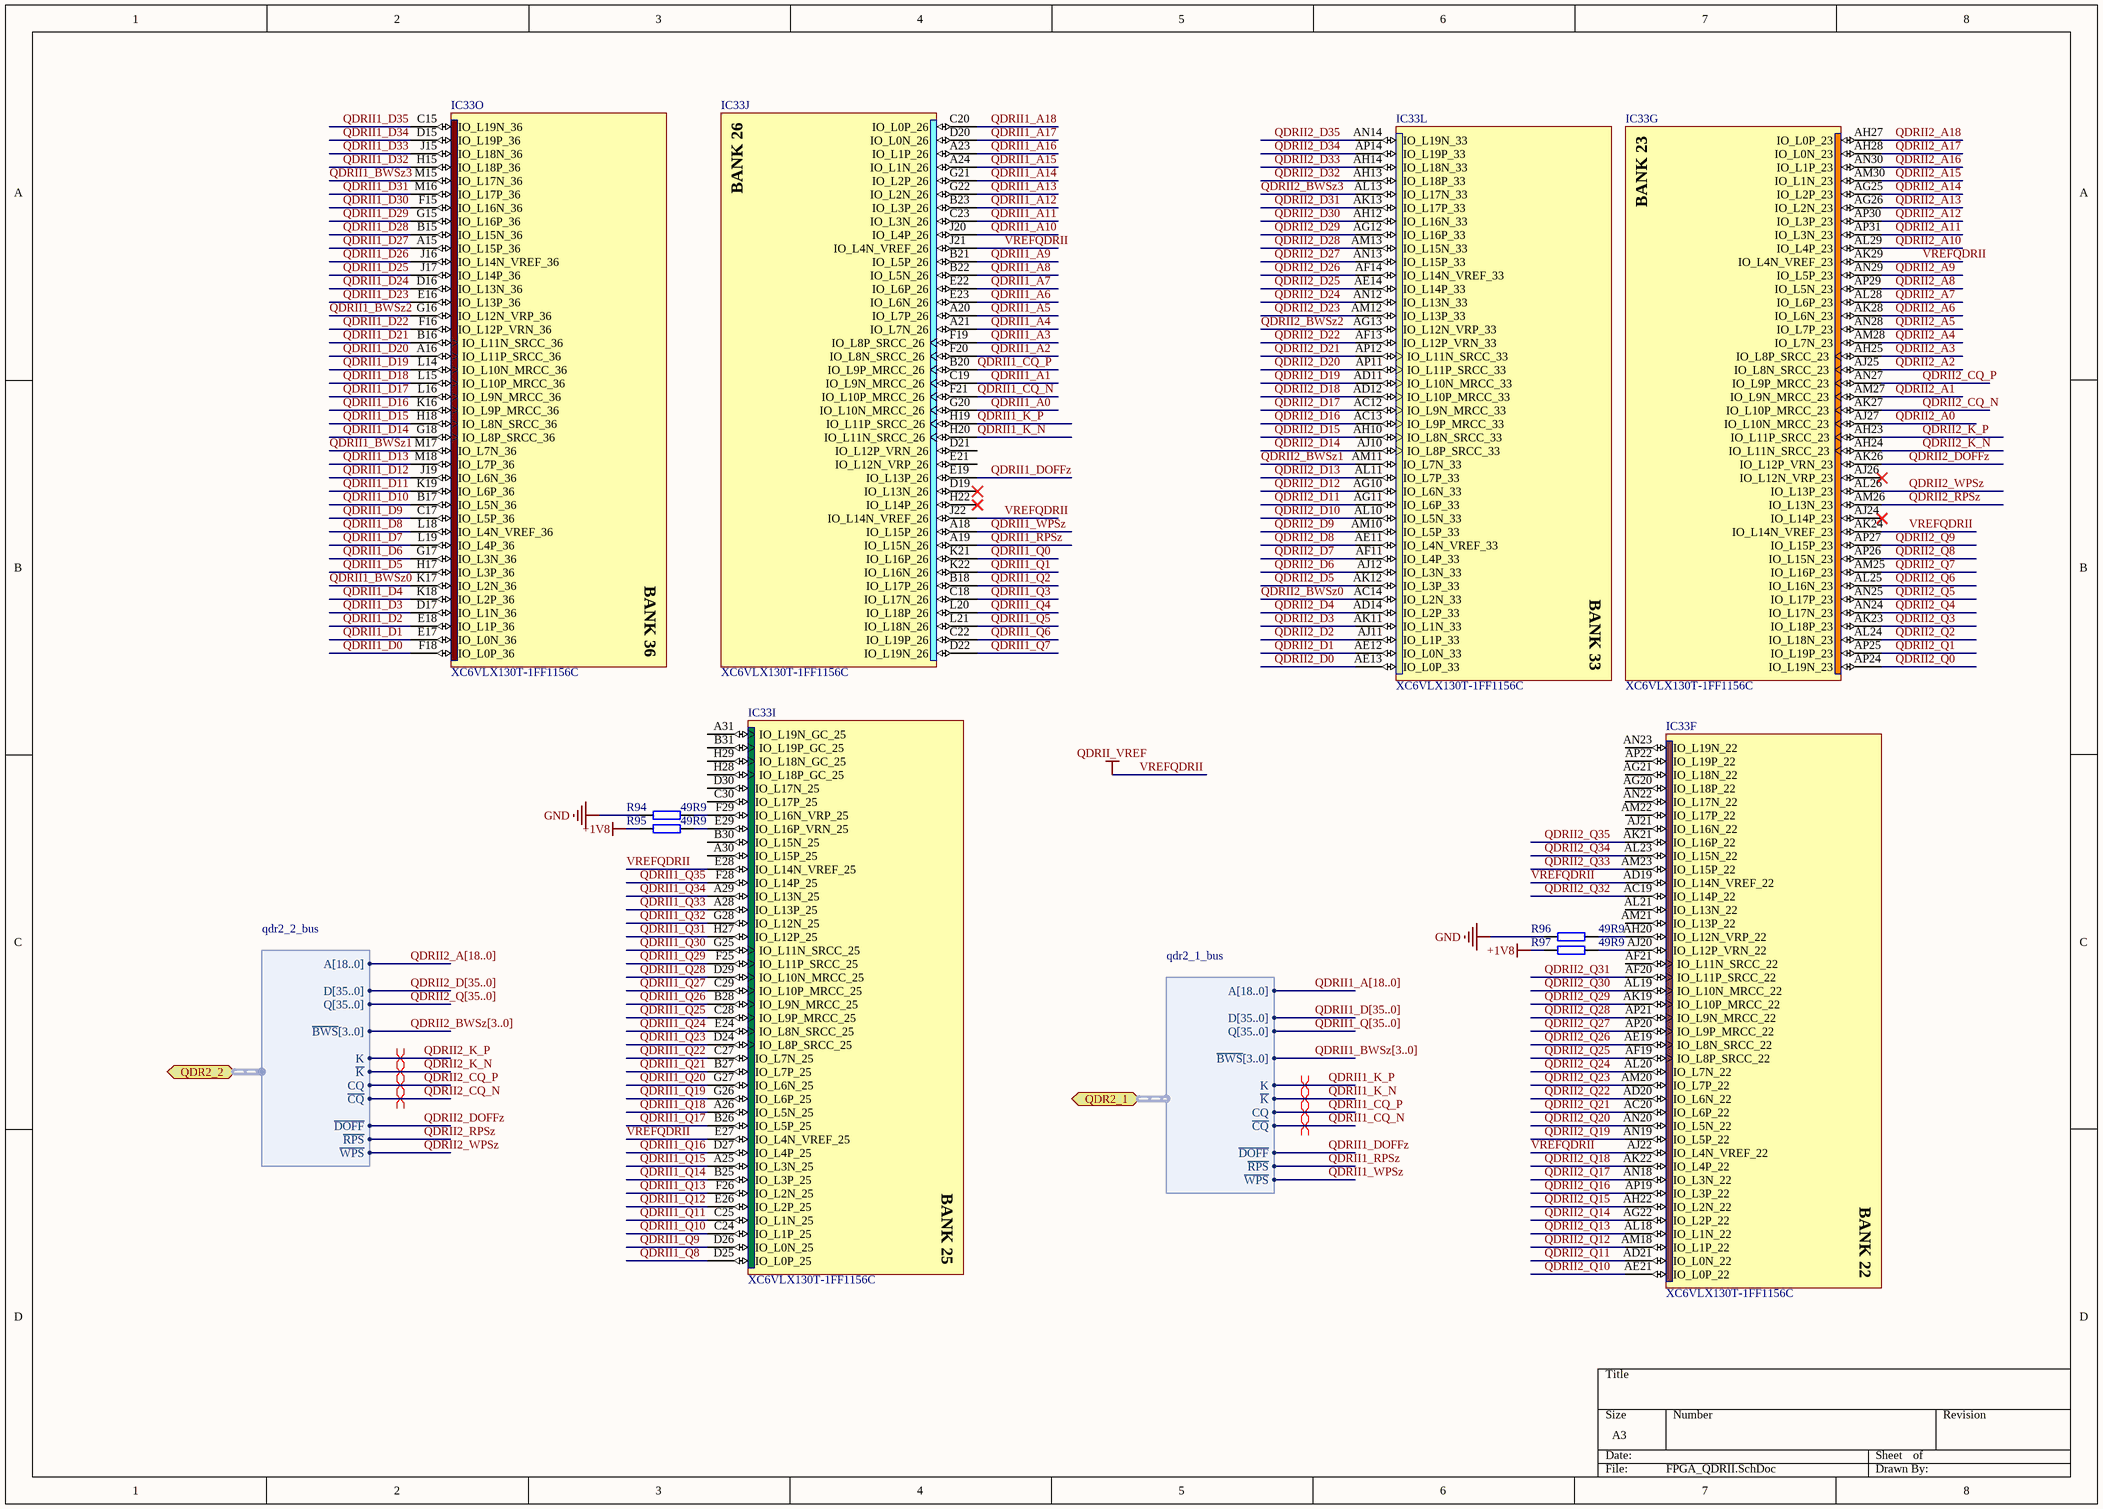
[diagram p21: FPGA_QDRII.SchDoc]

### Parts
IC33  XC6VLX130T-1FF1156C  [FF1156]  (parts F,G,I,J,L,O of 20)
R94  49R9  [0402]
R95  49R9  [0402]
R96  49R9  [0402]
R97  49R9  [0402]

### Ports
QDR2_1 (harness qdr2_1_bus), QDR2_2 (harness qdr2_2_bus)

### Harnesses
qdr2_1_bus: A[18..0], ~{BWS}[3..0], ~{CQ}, CQ, D[35..0], ~{DOFF}, K, ~{K}, Q[35..0], ~{RPS}, ~{WPS}
qdr2_2_bus: A[18..0], ~{BWS}[3..0], ~{CQ}, CQ, D[35..0], ~{DOFF}, K, ~{K}, Q[35..0], ~{RPS}, ~{WPS}

### Nets
+1V8: R95.2 R97.2
GND: R94.2 R96.2
VREFQDRII: IC33.AD19(IO_L14N_VREF_22) IC33.AJ22(IO_L4N_VREF_22) IC33.AK24(IO_L14N_VREF_23) IC33.AK29(IO_L4N_VREF_23) IC33.E27(IO_L4N_VREF_25) IC33.E28(IO_L14N_VREF_25) IC33.J21(IO_L4N_VREF_26) IC33.J22(IO_L14N_VREF_26)  [also labelled QDRII_VREF]
QDRII1_A0: IC33.G20(IO_L10N_MRCC_26)  [project net Q1_A0]
QDRII1_A1: IC33.C19(IO_L9N_MRCC_26)  [project net Q1_A1]
QDRII1_A2: IC33.F20(IO_L8N_SRCC_26)  [project net Q1_A2]
QDRII1_A3: IC33.F19(IO_L8P_SRCC_26)  [project net Q1_A3]
QDRII1_A4: IC33.A21(IO_L7N_26)  [project net Q1_A4]
QDRII1_A5: IC33.A20(IO_L7P_26)  [project net Q1_A5]
QDRII1_A6: IC33.E23(IO_L6N_26)  [project net Q1_A6]
QDRII1_A7: IC33.E22(IO_L6P_26)  [project net Q1_A7]
QDRII1_A8: IC33.B22(IO_L5N_26)  [project net Q1_A8]
QDRII1_A9: IC33.B21(IO_L5P_26)  [project net Q1_A9]
QDRII1_A10: IC33.J20(IO_L4P_26)  [project net Q1_A10]
QDRII1_A11: IC33.C23(IO_L3N_26)  [project net Q1_A11]
QDRII1_A12: IC33.B23(IO_L3P_26)  [project net Q1_A12]
QDRII1_A13: IC33.G22(IO_L2N_26)  [project net Q1_A13]
QDRII1_A14: IC33.G21(IO_L2P_26)  [project net Q1_A14]
QDRII1_A15: IC33.A24(IO_L1N_26)  [project net Q1_A15]
QDRII1_A16: IC33.A23(IO_L1P_26)  [project net Q1_A16]
QDRII1_A17: IC33.D20(IO_L0N_26)  [project net Q1_A17]
QDRII1_A18: IC33.C20(IO_L0P_26)  [project net Q1_A18]
QDRII1_BWSz0: IC33.K17(IO_L2N_36)  [project net Q1_BWS0]
QDRII1_BWSz1: IC33.M17(IO_L7N_36)  [project net Q1_BWS1]
QDRII1_BWSz2: IC33.G16(IO_L12N_VRP_36)  [project net Q1_BWS2]
QDRII1_BWSz3: IC33.M15(IO_L17N_36)  [project net Q1_BWS3]
QDRII1_CQ_N: IC33.F21(IO_L10P_MRCC_26) ; port QDR2_1.~{CQ}  [project net Q1_CQ_N]
QDRII1_CQ_P: IC33.B20(IO_L9P_MRCC_26) ; port QDR2_1.CQ  [project net Q1_CQ_P]
QDRII1_D0: IC33.F18(IO_L0P_36)  [project net Q1_D0]
QDRII1_D1: IC33.E17(IO_L0N_36)  [project net Q1_D1]
QDRII1_D2: IC33.E18(IO_L1P_36)  [project net Q1_D2]
QDRII1_D3: IC33.D17(IO_L1N_36)  [project net Q1_D3]
QDRII1_D4: IC33.K18(IO_L2P_36)  [project net Q1_D4]
QDRII1_D5: IC33.H17(IO_L3P_36)  [project net Q1_D5]
QDRII1_D6: IC33.G17(IO_L3N_36)  [project net Q1_D6]
QDRII1_D7: IC33.L19(IO_L4P_36)  [project net Q1_D7]
QDRII1_D8: IC33.L18(IO_L4N_VREF_36)  [project net Q1_D8]
QDRII1_D9: IC33.C17(IO_L5P_36)  [project net Q1_D9]
QDRII1_D10: IC33.B17(IO_L5N_36)  [project net Q1_D10]
QDRII1_D11: IC33.K19(IO_L6P_36)  [project net Q1_D11]
QDRII1_D12: IC33.J19(IO_L6N_36)  [project net Q1_D12]
QDRII1_D13: IC33.M18(IO_L7P_36)  [project net Q1_D13]
QDRII1_D14: IC33.G18(IO_L8P_SRCC_36)  [project net Q1_D14]
QDRII1_D15: IC33.H18(IO_L8N_SRCC_36)  [project net Q1_D15]
QDRII1_D16: IC33.K16(IO_L9P_MRCC_36)  [project net Q1_D16]
QDRII1_D17: IC33.L16(IO_L9N_MRCC_36)  [project net Q1_D17]
QDRII1_D18: IC33.L15(IO_L10P_MRCC_36)  [project net Q1_D18]
QDRII1_D19: IC33.L14(IO_L10N_MRCC_36)  [project net Q1_D19]
QDRII1_D20: IC33.A16(IO_L11P_SRCC_36)  [project net Q1_D20]
QDRII1_D21: IC33.B16(IO_L11N_SRCC_36)  [project net Q1_D21]
QDRII1_D22: IC33.F16(IO_L12P_VRN_36)  [project net Q1_D22]
QDRII1_D23: IC33.E16(IO_L13P_36)  [project net Q1_D23]
QDRII1_D24: IC33.D16(IO_L13N_36)  [project net Q1_D24]
QDRII1_D25: IC33.J17(IO_L14P_36)  [project net Q1_D25]
QDRII1_D26: IC33.J16(IO_L14N_VREF_36)  [project net Q1_D26]
QDRII1_D27: IC33.A15(IO_L15P_36)  [project net Q1_D27]
QDRII1_D28: IC33.B15(IO_L15N_36)  [project net Q1_D28]
QDRII1_D29: IC33.G15(IO_L16P_36)  [project net Q1_D29]
QDRII1_D30: IC33.F15(IO_L16N_36)  [project net Q1_D30]
QDRII1_D31: IC33.M16(IO_L17P_36)  [project net Q1_D31]
QDRII1_D32: IC33.H15(IO_L18P_36)  [project net Q1_D32]
QDRII1_D33: IC33.J15(IO_L18N_36)  [project net Q1_D33]
QDRII1_D34: IC33.D15(IO_L19P_36)  [project net Q1_D34]
QDRII1_D35: IC33.C15(IO_L19N_36)  [project net Q1_D35]
QDRII1_DOFFz: IC33.E19(IO_L13P_26) ; port QDR2_1.~{DOFF}  [project net Q1_DOFF]
QDRII1_K_N: IC33.H20(IO_L11N_SRCC_26) ; port QDR2_1.~{K}  [project net Q1_K_N]
QDRII1_K_P: IC33.H19(IO_L11P_SRCC_26) ; port QDR2_1.K  [project net Q1_K_P]
QDRII1_Q0: IC33.K21(IO_L16P_26)  [project net Q1_Q0]
QDRII1_Q1: IC33.K22(IO_L16N_26)  [project net Q1_Q1]
QDRII1_Q2: IC33.B18(IO_L17P_26)  [project net Q1_Q2]
QDRII1_Q3: IC33.C18(IO_L17N_26)  [project net Q1_Q3]
QDRII1_Q4: IC33.L20(IO_L18P_26)  [project net Q1_Q4]
QDRII1_Q5: IC33.L21(IO_L18N_26)  [project net Q1_Q5]
QDRII1_Q6: IC33.C22(IO_L19P_26)  [project net Q1_Q6]
QDRII1_Q7: IC33.D22(IO_L19N_26)  [project net Q1_Q7]
QDRII1_Q8: IC33.D25(IO_L0P_25)  [project net Q1_Q8]
QDRII1_Q9: IC33.D26(IO_L0N_25)  [project net Q1_Q9]
QDRII1_Q10: IC33.C24(IO_L1P_25)  [project net Q1_Q10]
QDRII1_Q11: IC33.C25(IO_L1N_25)  [project net Q1_Q11]
QDRII1_Q12: IC33.E26(IO_L2P_25)  [project net Q1_Q12]
QDRII1_Q13: IC33.F26(IO_L2N_25)  [project net Q1_Q13]
QDRII1_Q14: IC33.B25(IO_L3P_25)  [project net Q1_Q14]
QDRII1_Q15: IC33.A25(IO_L3N_25)  [project net Q1_Q15]
QDRII1_Q16: IC33.D27(IO_L4P_25)  [project net Q1_Q16]
QDRII1_Q17: IC33.B26(IO_L5P_25)  [project net Q1_Q17]
QDRII1_Q18: IC33.A26(IO_L5N_25)  [project net Q1_Q18]
QDRII1_Q19: IC33.G26(IO_L6P_25)  [project net Q1_Q19]
QDRII1_Q20: IC33.G27(IO_L6N_25)  [project net Q1_Q20]
QDRII1_Q21: IC33.B27(IO_L7P_25)  [project net Q1_Q21]
QDRII1_Q22: IC33.C27(IO_L7N_25)  [project net Q1_Q22]
QDRII1_Q23: IC33.D24(IO_L8P_SRCC_25)  [project net Q1_Q23]
QDRII1_Q24: IC33.E24(IO_L8N_SRCC_25)  [project net Q1_Q24]
QDRII1_Q25: IC33.C28(IO_L9P_MRCC_25)  [project net Q1_Q25]
QDRII1_Q26: IC33.B28(IO_L9N_MRCC_25)  [project net Q1_Q26]
QDRII1_Q27: IC33.C29(IO_L10P_MRCC_25)  [project net Q1_Q27]
QDRII1_Q28: IC33.D29(IO_L10N_MRCC_25)  [project net Q1_Q28]
QDRII1_Q29: IC33.F25(IO_L11P_SRCC_25)  [project net Q1_Q29]
QDRII1_Q30: IC33.G25(IO_L11N_SRCC_25)  [project net Q1_Q30]
QDRII1_Q31: IC33.H27(IO_L12P_25)  [project net Q1_Q31]
QDRII1_Q32: IC33.G28(IO_L12N_25)  [project net Q1_Q32]
QDRII1_Q33: IC33.A28(IO_L13P_25)  [project net Q1_Q33]
QDRII1_Q34: IC33.A29(IO_L13N_25)  [project net Q1_Q34]
QDRII1_Q35: IC33.F28(IO_L14P_25)  [project net Q1_Q35]
QDRII1_RPSz: IC33.A19(IO_L15N_26) ; port QDR2_1.~{RPS}  [project net Q1_RPS]
QDRII1_WPSz: IC33.A18(IO_L15P_26) ; port QDR2_1.~{WPS}  [project net Q1_WPS]
QDRII2_A0: IC33.AJ27(IO_L10N_MRCC_23)  [project net Q2_A0]
QDRII2_A1: IC33.AM27(IO_L9N_MRCC_23)  [project net Q2_A1]
QDRII2_A2: IC33.AJ25(IO_L8N_SRCC_23)  [project net Q2_A2]
QDRII2_A3: IC33.AH25(IO_L8P_SRCC_23)  [project net Q2_A3]
QDRII2_A4: IC33.AM28(IO_L7N_23)  [project net Q2_A4]
QDRII2_A5: IC33.AN28(IO_L7P_23)  [project net Q2_A5]
QDRII2_A6: IC33.AK28(IO_L6N_23)  [project net Q2_A6]
QDRII2_A7: IC33.AL28(IO_L6P_23)  [project net Q2_A7]
QDRII2_A8: IC33.AP29(IO_L5N_23)  [project net Q2_A8]
QDRII2_A9: IC33.AN29(IO_L5P_23)  [project net Q2_A9]
QDRII2_A10: IC33.AL29(IO_L4P_23)  [project net Q2_A10]
QDRII2_A11: IC33.AP31(IO_L3N_23)  [project net Q2_A11]
QDRII2_A12: IC33.AP30(IO_L3P_23)  [project net Q2_A12]
QDRII2_A13: IC33.AG26(IO_L2N_23)  [project net Q2_A13]
QDRII2_A14: IC33.AG25(IO_L2P_23)  [project net Q2_A14]
QDRII2_A15: IC33.AM30(IO_L1N_23)  [project net Q2_A15]
QDRII2_A16: IC33.AN30(IO_L1P_23)  [project net Q2_A16]
QDRII2_A17: IC33.AH28(IO_L0N_23)  [project net Q2_A17]
QDRII2_A18: IC33.AH27(IO_L0P_23)  [project net Q2_A18]
QDRII2_BWSz0: IC33.AC14(IO_L2N_33)  [project net Q2_BWS0]
QDRII2_BWSz1: IC33.AM11(IO_L7N_33)  [project net Q2_BWS1]
QDRII2_BWSz2: IC33.AG13(IO_L12N_VRP_33)  [project net Q2_BWS2]
QDRII2_BWSz3: IC33.AL13(IO_L17N_33)  [project net Q2_BWS3]
QDRII2_CQ_N: IC33.AK27(IO_L10P_MRCC_23) ; port QDR2_2.~{CQ}  [project net Q2_CQ_N]
QDRII2_CQ_P: IC33.AN27(IO_L9P_MRCC_23) ; port QDR2_2.CQ  [project net Q2_CQ_P]
QDRII2_D0: IC33.AE13(IO_L0P_33)  [project net Q2_D0]
QDRII2_D1: IC33.AE12(IO_L0N_33)  [project net Q2_D1]
QDRII2_D2: IC33.AJ11(IO_L1P_33)  [project net Q2_D2]
QDRII2_D3: IC33.AK11(IO_L1N_33)  [project net Q2_D3]
QDRII2_D4: IC33.AD14(IO_L2P_33)  [project net Q2_D4]
QDRII2_D5: IC33.AK12(IO_L3P_33)  [project net Q2_D5]
QDRII2_D6: IC33.AJ12(IO_L3N_33)  [project net Q2_D6]
QDRII2_D7: IC33.AF11(IO_L4P_33)  [project net Q2_D7]
QDRII2_D8: IC33.AE11(IO_L4N_VREF_33)  [project net Q2_D8]
QDRII2_D9: IC33.AM10(IO_L5P_33)  [project net Q2_D9]
QDRII2_D10: IC33.AL10(IO_L5N_33)  [project net Q2_D10]
QDRII2_D11: IC33.AG11(IO_L6P_33)  [project net Q2_D11]
QDRII2_D12: IC33.AG10(IO_L6N_33)  [project net Q2_D12]
QDRII2_D13: IC33.AL11(IO_L7P_33)  [project net Q2_D13]
QDRII2_D14: IC33.AJ10(IO_L8P_SRCC_33)  [project net Q2_D14]
QDRII2_D15: IC33.AH10(IO_L8N_SRCC_33)  [project net Q2_D15]
QDRII2_D16: IC33.AC13(IO_L9P_MRCC_33)  [project net Q2_D16]
QDRII2_D17: IC33.AC12(IO_L9N_MRCC_33)  [project net Q2_D17]
QDRII2_D18: IC33.AD12(IO_L10P_MRCC_33)  [project net Q2_D18]
QDRII2_D19: IC33.AD11(IO_L10N_MRCC_33)  [project net Q2_D19]
QDRII2_D20: IC33.AP11(IO_L11P_SRCC_33)  [project net Q2_D20]
QDRII2_D21: IC33.AP12(IO_L11N_SRCC_33)  [project net Q2_D21]
QDRII2_D22: IC33.AF13(IO_L12P_VRN_33)  [project net Q2_D22]
QDRII2_D23: IC33.AM12(IO_L13P_33)  [project net Q2_D23]
QDRII2_D24: IC33.AN12(IO_L13N_33)  [project net Q2_D24]
QDRII2_D25: IC33.AE14(IO_L14P_33)  [project net Q2_D25]
QDRII2_D26: IC33.AF14(IO_L14N_VREF_33)  [project net Q2_D26]
QDRII2_D27: IC33.AN13(IO_L15P_33)  [project net Q2_D27]
QDRII2_D28: IC33.AM13(IO_L15N_33)  [project net Q2_D28]
QDRII2_D29: IC33.AG12(IO_L16P_33)  [project net Q2_D29]
QDRII2_D30: IC33.AH12(IO_L16N_33)  [project net Q2_D30]
QDRII2_D31: IC33.AK13(IO_L17P_33)  [project net Q2_D31]
QDRII2_D32: IC33.AH13(IO_L18P_33)  [project net Q2_D32]
QDRII2_D33: IC33.AH14(IO_L18N_33)  [project net Q2_D33]
QDRII2_D34: IC33.AP14(IO_L19P_33)  [project net Q2_D34]
QDRII2_D35: IC33.AN14(IO_L19N_33)  [project net Q2_D35]
QDRII2_DOFFz: IC33.AK26(IO_L12P_VRN_23) ; port QDR2_2.~{DOFF}  [project net Q2_DOFF]
QDRII2_K_N: IC33.AH24(IO_L11N_SRCC_23) ; port QDR2_2.~{K}  [project net Q2_K_N]
QDRII2_K_P: IC33.AH23(IO_L11P_SRCC_23) ; port QDR2_2.K  [project net Q2_K_P]
QDRII2_Q0: IC33.AP24(IO_L19N_23)  [project net Q2_Q0]
QDRII2_Q1: IC33.AP25(IO_L19P_23)  [project net Q2_Q1]
QDRII2_Q2: IC33.AL24(IO_L18N_23)  [project net Q2_Q2]
QDRII2_Q3: IC33.AK23(IO_L18P_23)  [project net Q2_Q3]
QDRII2_Q4: IC33.AN24(IO_L17N_23)  [project net Q2_Q4]
QDRII2_Q5: IC33.AN25(IO_L17P_23)  [project net Q2_Q5]
QDRII2_Q6: IC33.AL25(IO_L16N_23)  [project net Q2_Q6]
QDRII2_Q7: IC33.AM25(IO_L16P_23)  [project net Q2_Q7]
QDRII2_Q8: IC33.AP26(IO_L15N_23)  [project net Q2_Q8]
QDRII2_Q9: IC33.AP27(IO_L15P_23)  [project net Q2_Q9]
QDRII2_Q10: IC33.AE21(IO_L0P_22)  [project net Q2_Q10]
QDRII2_Q11: IC33.AD21(IO_L0N_22)  [project net Q2_Q11]
QDRII2_Q12: IC33.AM18(IO_L1P_22)  [project net Q2_Q12]
QDRII2_Q13: IC33.AL18(IO_L1N_22)  [project net Q2_Q13]
QDRII2_Q14: IC33.AG22(IO_L2P_22)  [project net Q2_Q14]
QDRII2_Q15: IC33.AH22(IO_L2N_22)  [project net Q2_Q15]
QDRII2_Q16: IC33.AP19(IO_L3P_22)  [project net Q2_Q16]
QDRII2_Q17: IC33.AN18(IO_L3N_22)  [project net Q2_Q17]
QDRII2_Q18: IC33.AK22(IO_L4P_22)  [project net Q2_Q18]
QDRII2_Q19: IC33.AN19(IO_L5P_22)  [project net Q2_Q19]
QDRII2_Q20: IC33.AN20(IO_L5N_22)  [project net Q2_Q20]
QDRII2_Q21: IC33.AC20(IO_L6P_22)  [project net Q2_Q21]
QDRII2_Q22: IC33.AD20(IO_L6N_22)  [project net Q2_Q22]
QDRII2_Q23: IC33.AM20(IO_L7P_22)  [project net Q2_Q23]
QDRII2_Q24: IC33.AL20(IO_L7N_22)  [project net Q2_Q24]
QDRII2_Q25: IC33.AF19(IO_L8P_SRCC_22)  [project net Q2_Q25]
QDRII2_Q26: IC33.AE19(IO_L8N_SRCC_22)  [project net Q2_Q26]
QDRII2_Q27: IC33.AP20(IO_L9P_MRCC_22)  [project net Q2_Q27]
QDRII2_Q28: IC33.AP21(IO_L9N_MRCC_22)  [project net Q2_Q28]
QDRII2_Q29: IC33.AK19(IO_L10P_MRCC_22)  [project net Q2_Q29]
QDRII2_Q30: IC33.AL19(IO_L10N_MRCC_22)  [project net Q2_Q30]
QDRII2_Q31: IC33.AF20(IO_L11P_SRCC_22)  [project net Q2_Q31]
QDRII2_Q32: IC33.AC19(IO_L14P_22)  [project net Q2_Q32]
QDRII2_Q33: IC33.AM23(IO_L15P_22)  [project net Q2_Q33]
QDRII2_Q34: IC33.AL23(IO_L15N_22)  [project net Q2_Q34]
QDRII2_Q35: IC33.AK21(IO_L16P_22)  [project net Q2_Q35]
QDRII2_RPSz: IC33.AM26(IO_L13N_23) ; port QDR2_2.~{RPS}  [project net Q2_RPS]
QDRII2_WPSz: IC33.AL26(IO_L13P_23) ; port QDR2_2.~{WPS}  [project net Q2_WPS]
NetIC33_AH20: IC33.AH20(IO_L12N_VRP_22) R96.1
NetIC33_AJ20: IC33.AJ20(IO_L12P_VRN_22) R97.1
NetIC33_E29: IC33.E29(IO_L16P_VRN_25) R95.1
NetIC33_F29: IC33.F29(IO_L16N_VRP_25) R94.1

Not connected (* = marked no-connect by the designer): IC33 A30(IO_L15P_25) A31(IO_L19N_GC_25) AF21(IO_L11N_SRCC_22) AG20(IO_L18P_22) AG21(IO_L18N_22) AJ21(IO_L16N_22) AJ24(IO_L14P_23)* AJ26(IO_L12N_VRP_23)* AL21(IO_L13N_22) AM21(IO_L13P_22) AM22(IO_L17P_22) AN22(IO_L17N_22) AN23(IO_L19N_22) AP22(IO_L19P_22) B30(IO_L15N_25) B31(IO_L19P_GC_25) C30(IO_L17P_25) D19(IO_L13N_26)* D21(IO_L12P_VRN_26) D30(IO_L17N_25) E21(IO_L12N_VRP_26) H22(IO_L14P_26)* H28(IO_L18P_GC_25) H29(IO_L18N_GC_25)

### Buses and harness runs
bus QDRII1_A[18..0]
bus QDRII1_BWSz[3..0]
bus QDRII1_D[35..0]
bus QDRII1_Q[35..0]
bus QDRII2_A[18..0]
bus QDRII2_BWSz[3..0]
bus QDRII2_D[35..0]
bus QDRII2_Q[35..0]

### Layout directives
differential pair: Q1_CQ_N, Q1_CQ_P, Q1_K_N, Q1_K_P, Q2_CQ_N, Q2_CQ_P, Q2_K_N, Q2_K_P

### Notes on the sheet
- (in symbol XC6VLX130T-1FF1156C, part F) BANK 22
- (in symbol XC6VLX130T-1FF1156C, part G) BANK 23
- (in symbol XC6VLX130T-1FF1156C, part I) BANK 25
- (in symbol XC6VLX130T-1FF1156C, part J) BANK 26
- (in symbol XC6VLX130T-1FF1156C, part L) BANK 33
- (in symbol XC6VLX130T-1FF1156C, part O) BANK 36

### Library data of the parts
IC33 = XC6VLX130T-1FF1156C: Virtex-6 LXT Platform FPGA, 600 User I/Os, 20 GTXs, 1156-Ball FFBGA, Speed Grade 1, Commercial Grade; FirstPublished: 17-Nov-2009; DatasheetVersion: v2.0, Sep-2009; PackageVersion: ver1.0, Jun-2009; PackageReference: FF1156; Publisher: Altium Limited; PackageDescription: 1156-Ball Flip-Chip Fine Pitch Ball Grid Array (FF1156); Code_JEDEC: MS-034-AAR-1; Code_IPC: BGA100P34X34-1156; ComponentLink1Description: Virtex-6 Datasheet; ComponentLink1URL: http://www.xilinx.com/support/documentation/data_sheets/ds150.pdf; ComponentLink2Description: Pinout Specification; ComponentLink2URL: http://www.xilinx.com/support/packagefiles/virtex-6-pkgs.htm; ComponentLink3Description: FF1156 Package Drawing; ComponentLink3URL: http://www.xilinx.com/support/documentation/package_specs/ff1156.pdf; ComponentLink4Description: Virtex-6 Documents; ComponentLink4URL: http://www.xilinx.com/support/documentation/virtex-6.htm; ComponentLink5Description: Xilinx.com Home; ComponentLink5URL: http://www.xilinx.com
R94-R97 = R0402_49R9_±1%_0.1W_100PPM: SMD Resistor; Manufacturer1: Panasonic; Manufacturer1 PN: ERJ-2RKF49R9X; TCR: 100ppm; Power Rating: 0.1W; Tolerance: ±1%; Case: 0402; Distributor1: DigiKey; Distributor1 PN: P49.9LCT-ND; Value: 49R9

## Sheet FPGA_Peripherals_Control.SchDoc
size A4
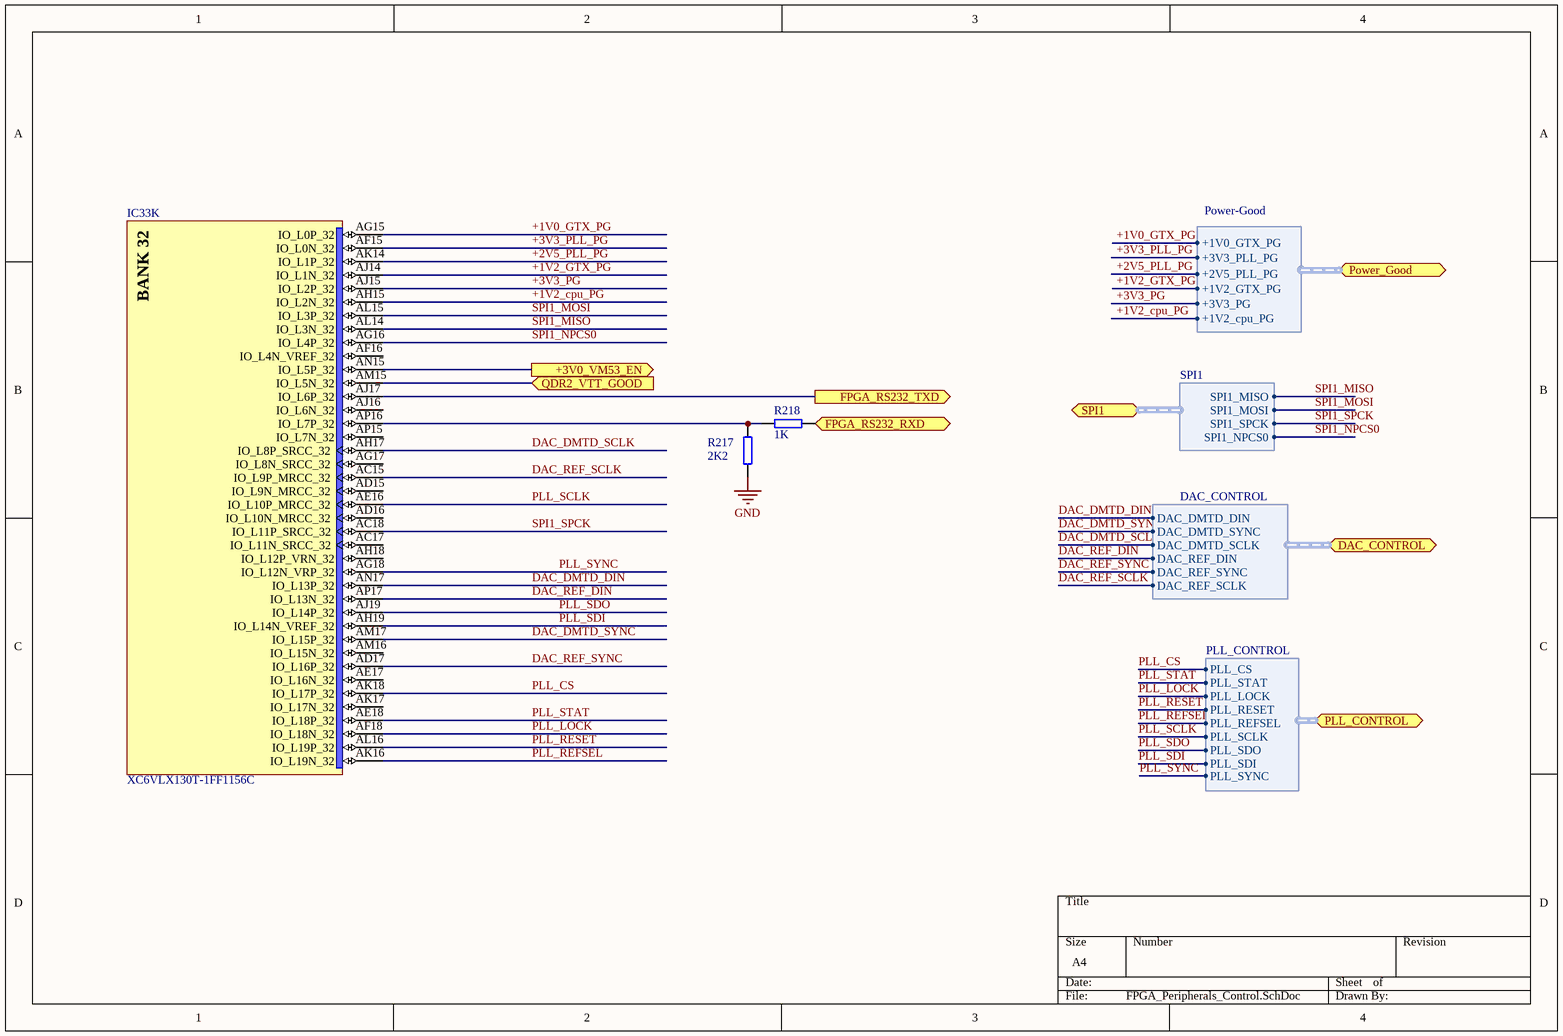
[diagram p22: FPGA_Peripherals_Control.SchDoc]

### Parts
IC33  XC6VLX130T-1FF1156C  [FF1156]  (part K of 20)
R217  2K2  [0402]
R218  1K  [0402]

### Ports
+3V0_VM53_EN (out), DAC_CONTROL (harness DAC_CONTROL), FPGA_RS232_RXD (in), FPGA_RS232_TXD (out), PLL_CONTROL (harness PLL_CONTROL), Power_Good (harness Power-Good), QDR2_VTT_GOOD (in), SPI1 (harness SPI1)

### Harnesses
SPI1: SPI1_MISO, SPI1_MOSI, SPI1_SPCK, SPI1_NPCS0
Power-Good: +1V2_GTX_PG, +2V5_PLL_PG, +3V3_PLL_PG, +1V0_GTX_PG, +3V3_PG, +1V2_cpu_PG
DAC_CONTROL: DAC_DMTD_DIN, DAC_DMTD_SYNC, DAC_DMTD_SCLK, DAC_REF_DIN, DAC_REF_SYNC, DAC_REF_SCLK
PLL_CONTROL: PLL_CS, PLL_STAT, PLL_LOCK, PLL_RESET, PLL_REFSEL, PLL_SCLK, PLL_SDO, PLL_SDI, PLL_SYNC

### Nets
GND: R217.2
+1V0_GTX_PG: IC33.AG15(IO_L0P_32) ; port Power_Good.+1V0_GTX_PG
+1V2_cpu_PG: IC33.AH15(IO_L2N_32) ; port Power_Good.+1V2_cpu_PG
+1V2_GTX_PG: IC33.AJ14(IO_L1N_32) ; port Power_Good.+1V2_GTX_PG
+2V5_PLL_PG: IC33.AK14(IO_L1P_32) ; port Power_Good.+2V5_PLL_PG
+3V0_VM53_EN: IC33.AN15(IO_L5P_32) ; port +3V0_VM53_EN
+3V3_PG: IC33.AJ15(IO_L2P_32) ; port Power_Good.+3V3_PG
+3V3_PLL_PG: IC33.AF15(IO_L0N_32) ; port Power_Good.+3V3_PLL_PG
DAC_DMTD_DIN: IC33.AN17(IO_L13P_32) ; port DAC_CONTROL.DAC_DMTD_DIN  [project net DAC_CONTROL.DAC_DMTD_DIN]
DAC_DMTD_SCLK: IC33.AH17(IO_L8P_SRCC_32) ; port DAC_CONTROL.DAC_DMTD_SCLK  [project net DAC_CONTROL.DAC_DMTD_SCLK]
DAC_DMTD_SYNC: IC33.AM17(IO_L15P_32) ; port DAC_CONTROL.DAC_DMTD_SYNC  [project net DAC_CONTROL.DAC_DMTD_SYNC]
DAC_REF_DIN: IC33.AP17(IO_L13N_32) ; port DAC_CONTROL.DAC_REF_DIN  [project net DAC_CONTROL.DAC_REF_DIN]
DAC_REF_SCLK: IC33.AC15(IO_L9P_MRCC_32) ; port DAC_CONTROL.DAC_REF_SCLK  [project net DAC_CONTROL.DAC_REF_SCLK]
DAC_REF_SYNC: IC33.AD17(IO_L16P_32) ; port DAC_CONTROL.DAC_REF_SYNC  [project net DAC_CONTROL.DAC_REF_SYNC]
FPGA_RS232_RXD: R218.1 ; port FPGA_RS232_RXD
FPGA_RS232_TXD: IC33.AJ17(IO_L6P_32) ; port FPGA_RS232_TXD
PLL_CS: IC33.AK18(IO_L17P_32) ; port PLL_CONTROL.PLL_CS  [project net PLL_CONTROL.PLL_CS]
PLL_LOCK: IC33.AF18(IO_L18N_32) ; port PLL_CONTROL.PLL_LOCK  [project net PLL_CONTROL.PLL_LOCK]
PLL_REFSEL: IC33.AK16(IO_L19N_32) ; port PLL_CONTROL.PLL_REFSEL  [project net PLL_CONTROL.PLL_REFSEL]
PLL_RESET: IC33.AL16(IO_L19P_32) ; port PLL_CONTROL.PLL_RESET  [project net PLL_CONTROL.PLL_RESET]
PLL_SCLK: IC33.AE16(IO_L10P_MRCC_32) ; port PLL_CONTROL.PLL_SCLK  [project net PLL_CONTROL.PLL_SCLK]
PLL_SDI: IC33.AH19(IO_L14N_VREF_32) ; port PLL_CONTROL.PLL_SDI  [project net PLL_CONTROL.PLL_SDI]
PLL_SDO: IC33.AJ19(IO_L14P_32) ; port PLL_CONTROL.PLL_SDO  [project net PLL_CONTROL.PLL_SDO]
PLL_STAT: IC33.AE18(IO_L18P_32) ; port PLL_CONTROL.PLL_STAT  [project net PLL_CONTROL.PLL_STAT]
PLL_SYNC: IC33.AG18(IO_L12N_VRP_32) ; port PLL_CONTROL.PLL_SYNC  [project net PLL_CONTROL.PLL_SYNC]
QDR2_VTT_GOOD: IC33.AM15(IO_L5N_32) ; port QDR2_VTT_GOOD
SPI1_MISO: IC33.AL14(IO_L3N_32) ; port SPI1.SPI1_MISO  [project net SPI1.SPI1_MISO]
SPI1_MOSI: IC33.AL15(IO_L3P_32) ; port SPI1.SPI1_MOSI  [project net SPI1.SPI1_MOSI]
SPI1_NPCS0: IC33.AG16(IO_L4P_32) ; port SPI1.SPI1_NPCS0  [project net SPI1.SPI1_NPCS0]
SPI1_SPCK: IC33.AC18(IO_L11P_SRCC_32) ; port SPI1.SPI1_SPCK  [project net SPI1.SPI1_SPCK]
NetIC33_AP16: IC33.AP16(IO_L7P_32) R217.1 R218.2

Not connected (* = marked no-connect by the designer): IC33 AC17(IO_L11N_SRCC_32) AD15(IO_L9N_MRCC_32) AD16(IO_L10N_MRCC_32) AE17(IO_L16N_32) AF16(IO_L4N_VREF_32) AG17(IO_L8N_SRCC_32) AH18(IO_L12P_VRN_32) AJ16(IO_L6N_32) AK17(IO_L17N_32) AM16(IO_L15N_32) AP15(IO_L7N_32)

### Notes on the sheet
- (in symbol XC6VLX130T-1FF1156C, part K) BANK 32
- (in symbol XC6VLX130T-1FF1156C, part I) BANK 25
- (in symbol XC6VLX130T-1FF1156C, part J) BANK 26
- (in symbol XC6VLX130T-1FF1156C, part O) BANK 36

### Library data of the parts
IC33 = XC6VLX130T-1FF1156C: as IC33 on sheet FPGA_QDRII; FirstPublished: 17-Nov-2009; DatasheetVersion: v2.0, Sep-2009; PackageVersion: ver1.0, Jun-2009; PackageReference: FF1156; Publisher: Altium Limited; PackageDescription: 1156-Ball Flip-Chip Fine Pitch Ball Grid Array (FF1156); Code_JEDEC: MS-034-AAR-1; Code_IPC: BGA100P34X34-1156; ComponentLink1Description: Virtex-6 Datasheet; ComponentLink1URL: http://www.xilinx.com/support/documentation/data_sheets/ds150.pdf; ComponentLink2Description: Pinout Specification; ComponentLink2URL: http://www.xilinx.com/support/packagefiles/virtex-6-pkgs.htm; ComponentLink3Description: FF1156 Package Drawing; ComponentLink3URL: http://www.xilinx.com/support/documentation/package_specs/ff1156.pdf; ComponentLink4Description: Virtex-6 Documents; ComponentLink4URL: http://www.xilinx.com/support/documentation/virtex-6.htm; ComponentLink5Description: Xilinx.com Home; ComponentLink5URL: http://www.xilinx.com
R217 = R0402_2K2_±1%_0.1W_100PPM: SMD Resistor; Manufacturer1: Panasonic; Manufacturer1 PN: ERJ-2RKF2201X; TCR: 100ppm; Power Rating: 0.1W; Tolerance: ±1%; Case: 0402; Distributor1: DigiKey; Distributor1 PN: P2.20KLCT-ND; Value: 2K2
R218 = R0402_1K_±1%_0.1W_100PPM: SMD Resistor; Manufacturer1: Panasonic; Manufacturer1 PN: ERJ-2RKF1001X; TCR: 100ppm; Power Rating: 0.1W; Tolerance: ±1%; Case: 0402; Distributor1: DigiKey; Distributor1 PN: P1.00KLCT-ND; Value: 1K